# EAGLE schematic IGOR_1 (EAGLE 6.5.0)

## Sheet 1 of 12
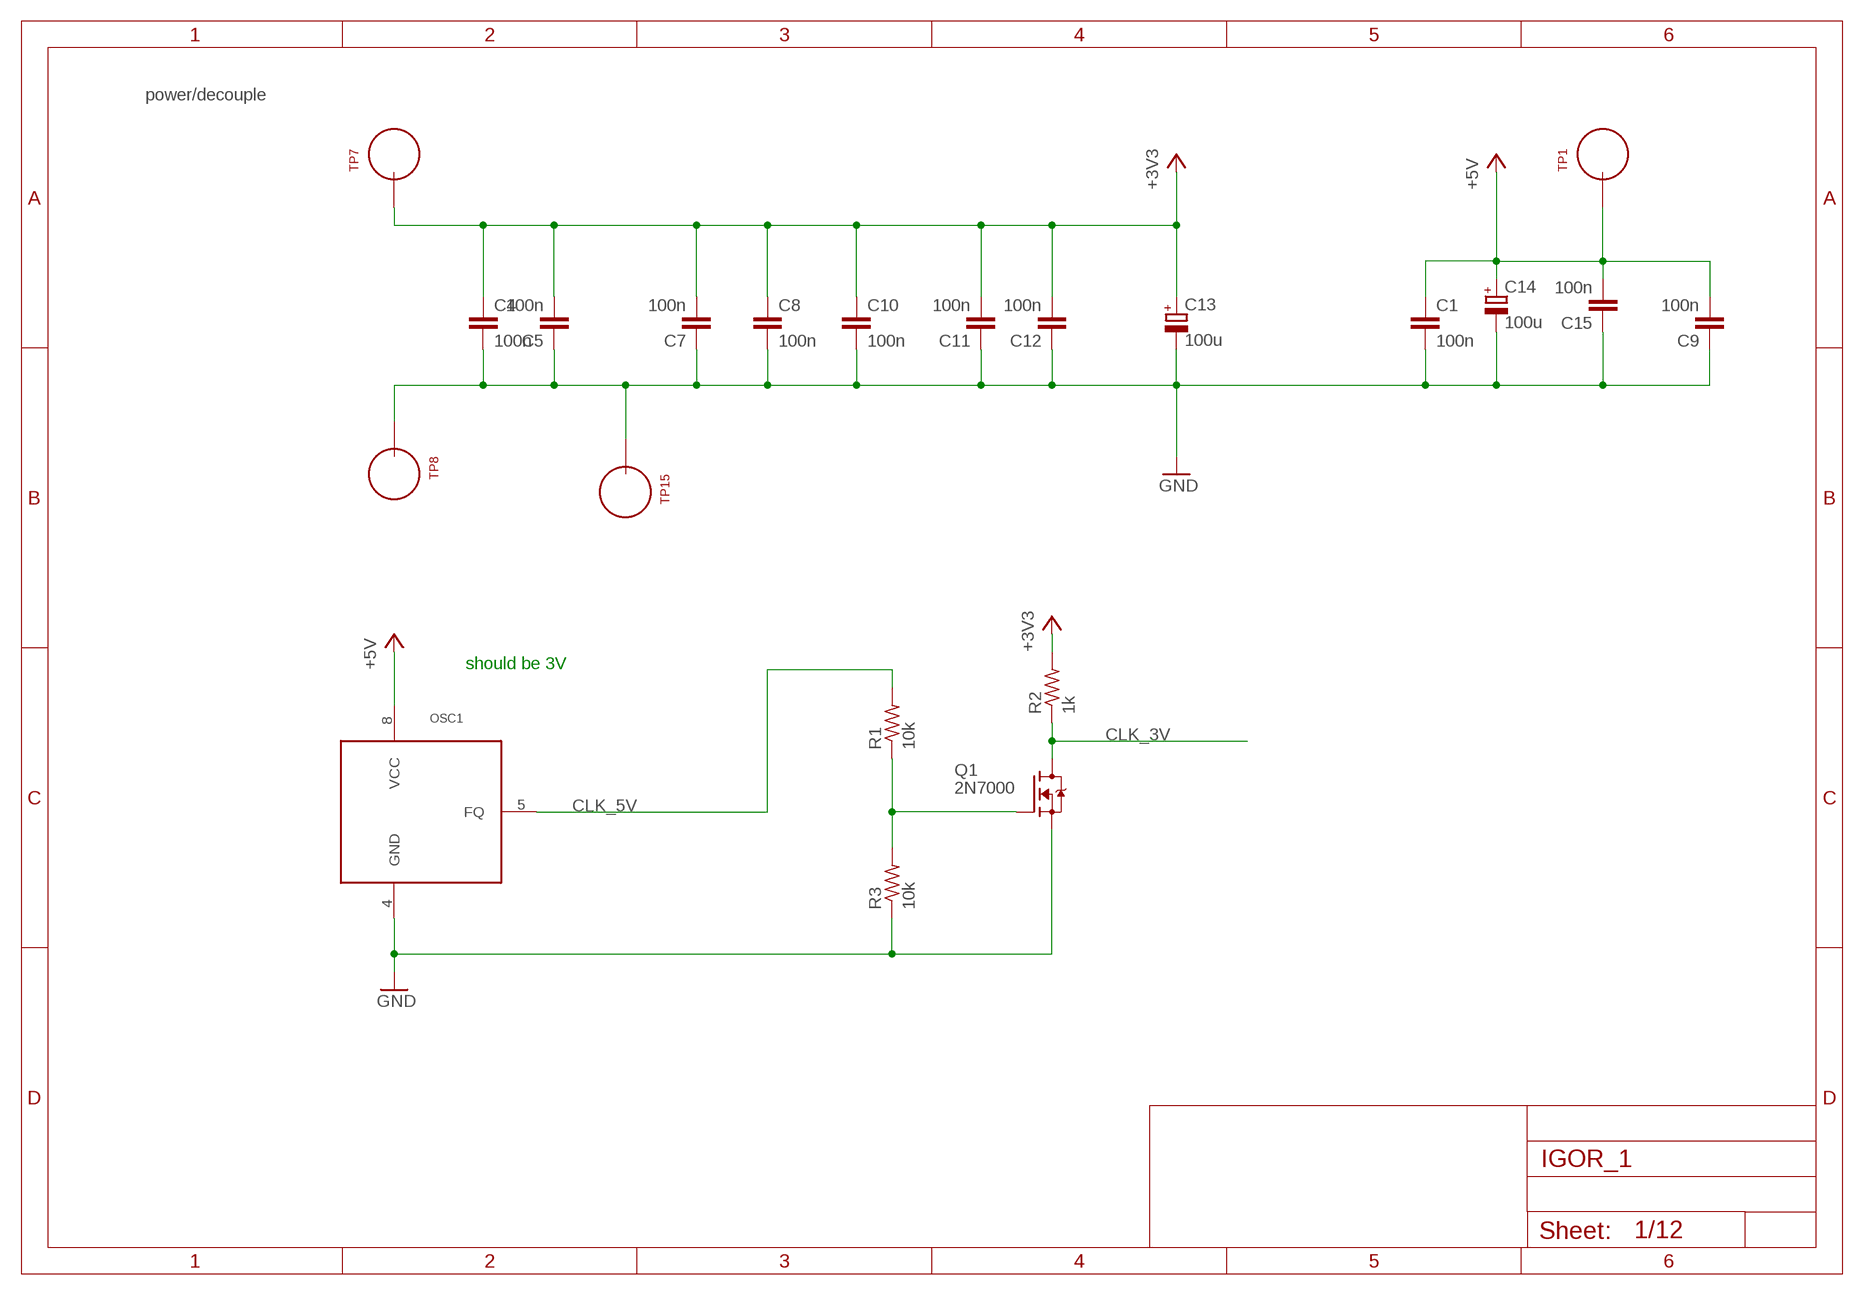
[diagram p0: schematic, sheet 1]

### Parts
C1  100n  C_P2INCH  [CAP_P2INCH]
C4  100n  C_P2INCH  [CAP_P2INCH]
C5  100n  C_P2INCH  [CAP_P2INCH]
C7  100n  C_P2INCH  [CAP_P2INCH]
C8  100n  C_P2INCH  [CAP_P2INCH]
C9  100n  C_P2INCH  [CAP_P2INCH]
C10  100n  C_P2INCH  [CAP_P2INCH]
C11  100n  C_P2INCH  [CAP_P2INCH]
C12  100n  C_P2INCH  [CAP_P2INCH]
C13  100u  POLARISED_CAP_2P5_6P3MM  [POLARISED_CAP_2P5_6P3MM]
C14  100u  POLARISED_CAP_2P5_6P3MM  [POLARISED_CAP_2P5_6P3MM]
C15  100n  C_P2INCH  [CAP_P2INCH]
OSC1  OSC_12P9_MM  [OSC_12P9_MM]
Q1  2N7000  [TO92-DGS]
R1  10k  R_P2INCH  [R_P2INCH]
R2  1k  R_P2INCH  [R_P2INCH]
R3  10k  R_P2INCH  [R_P2INCH]
TP1  TEST_LOOP  [TEST_LOOP]
TP7  TEST_LOOP  [TEST_LOOP]
TP8  TEST_LOOP  [TEST_LOOP]
TP15  TEST_LOOP  [TEST_LOOP]

### Nets
+3V3: C4.1 C5.2 C7.2 C8.1 C10.1 C11.2 C12.2 C13.A R2.2 TP7.P$1 ; also sheet 5,6,7,9,11
+5V: C1.1 C9.2 C14.A C15.2 OSC1.8(VCC) TP1.P$1 ; also sheet 2,5,8
CLK_3V: Q1.D R2.1 ; also sheet 3
CLK_5V: Q1.G R1.1 R3.2
GND: C1.2 C4.2 C5.1 C7.1 C8.2 C9.1 C10.2 C11.1 C12.1 C13.K C14.K C15.1 OSC1.4(GND) Q1.S R3.1 TP8.P$1 TP15.P$1 ; also sheet 2,3,4,5,6,7,8,9,10,11,12
N$3: OSC1.5(FQ) R1.2

### Notes on the sheet
- power/decouple
- should be 3V

## Sheet 2 of 12
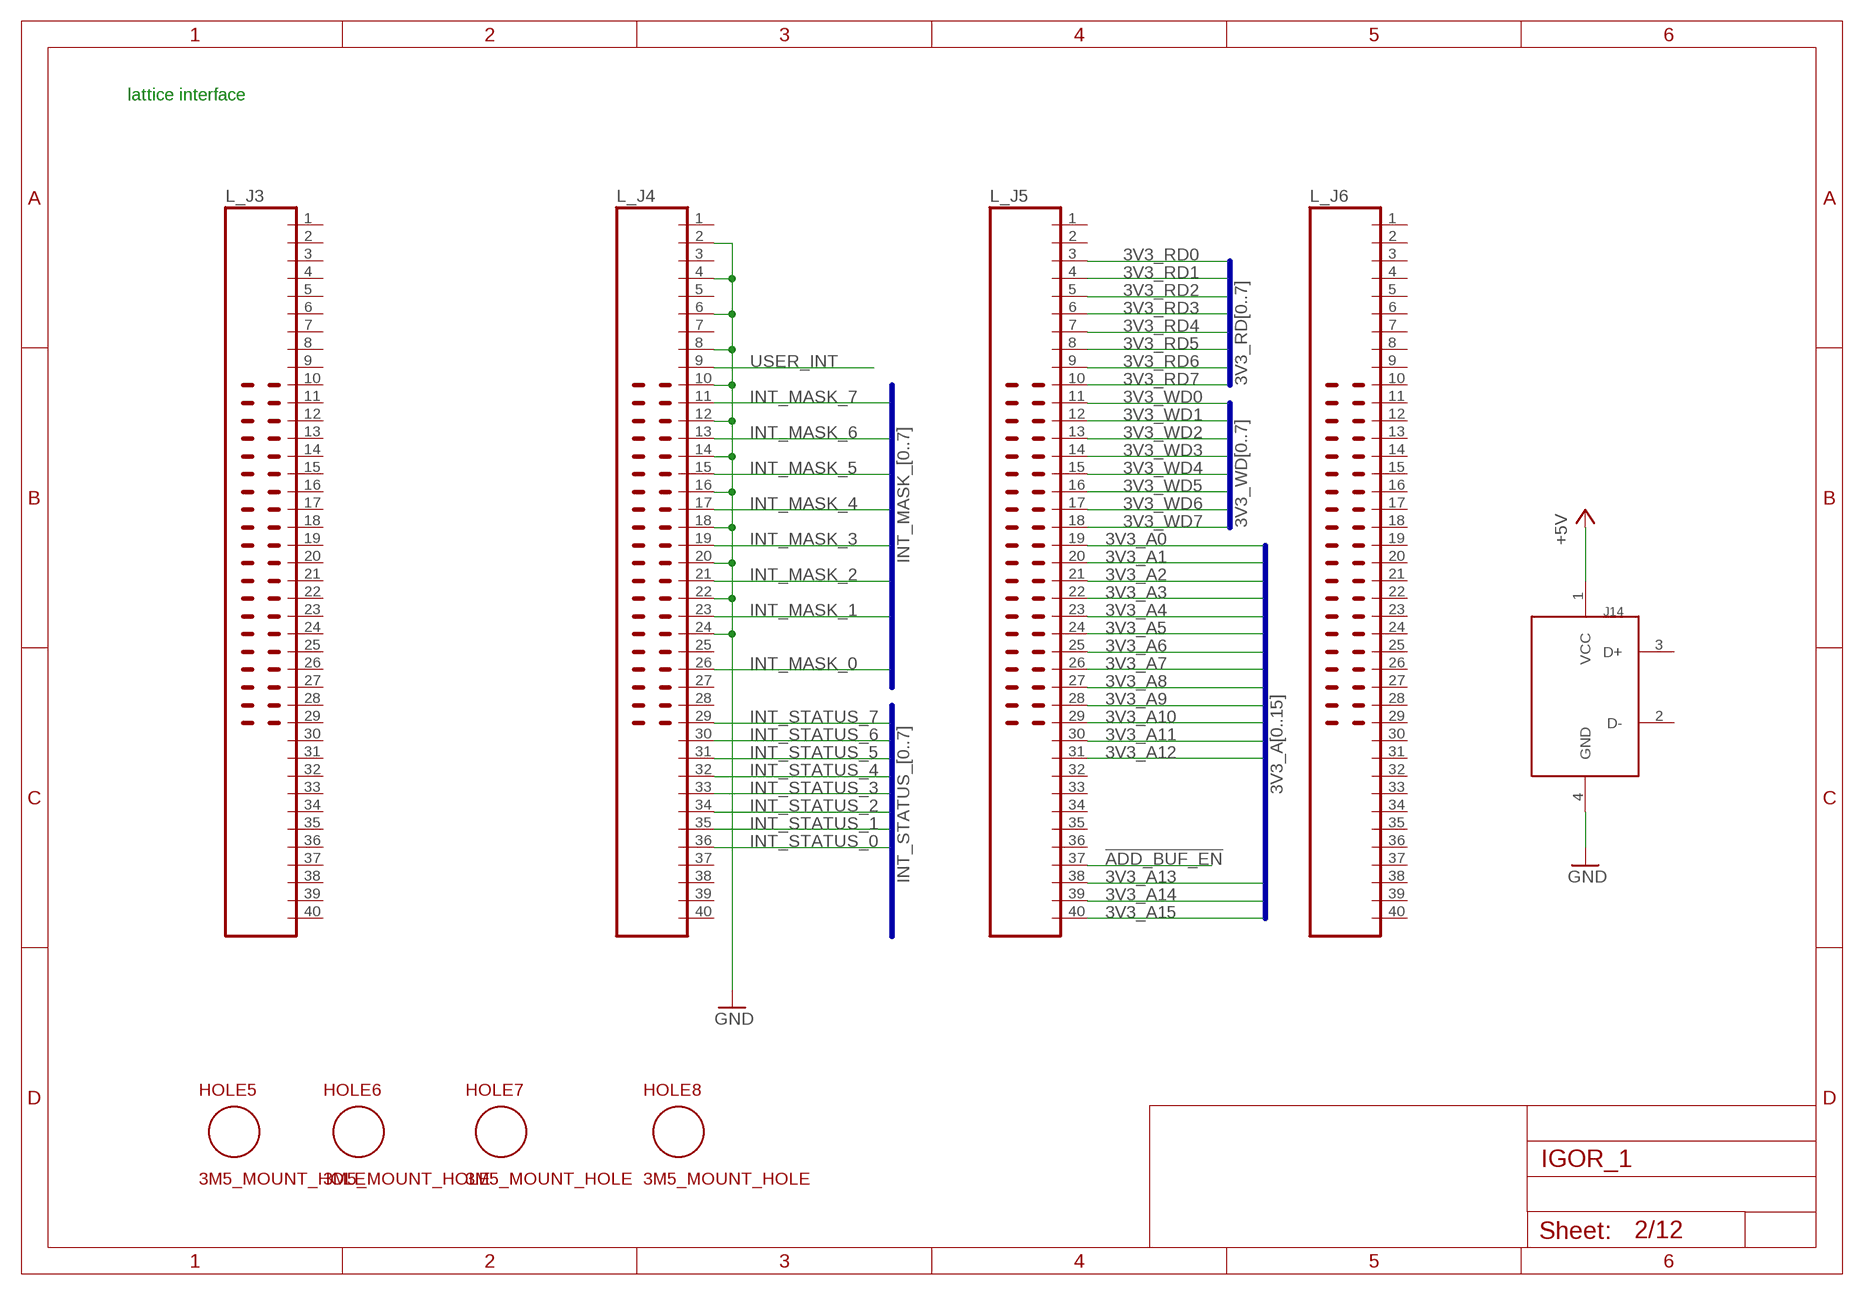
[diagram p1: schematic, sheet 2]

### Parts
HOLE5  3M5_MOUNT_HOLE  [3P5M_HOLE]
HOLE6  3M5_MOUNT_HOLE  [3P5M_HOLE]
HOLE7  3M5_MOUNT_HOLE  [3P5M_HOLE]
HOLE8  3M5_MOUNT_HOLE  [3P5M_HOLE]
J14  USB_TYPE_A  [USB_TYPE_A]
L_J3  JUMP_20X2  [JUMP_20X2]
L_J4  JUMP_20X2  [JUMP_20X2]
L_J5  JUMP_20X2  [JUMP_20X2]
L_J6  JUMP_20X2  [JUMP_20X2]

### Nets
3V3_A0: L_J5.19 ; also sheet 5,7
3V3_A1: L_J5.20 ; also sheet 5,7
3V3_A2: L_J5.21 ; also sheet 5,7
3V3_A3: L_J5.22 ; also sheet 5,7
3V3_A4: L_J5.23 ; also sheet 5,7
3V3_A5: L_J5.24 ; also sheet 5,7
3V3_A6: L_J5.25 ; also sheet 5,7
3V3_A7: L_J5.26 ; also sheet 5,7
3V3_A8: L_J5.27 ; also sheet 5,7
3V3_A9: L_J5.28 ; also sheet 5,7
3V3_A10: L_J5.29 ; also sheet 5,7
3V3_A11: L_J5.30 ; also sheet 5,7
3V3_A12: L_J5.31 ; also sheet 5,7
3V3_A13: L_J5.38 ; also sheet 5,7
3V3_A14: L_J5.39 ; also sheet 5,7
3V3_A15: L_J5.40 ; also sheet 5
3V3_RD0: L_J5.3 ; also sheet 5
3V3_RD1: L_J5.4 ; also sheet 5
3V3_RD2: L_J5.5 ; also sheet 5
3V3_RD3: L_J5.6 ; also sheet 5
3V3_RD4: L_J5.7 ; also sheet 5
3V3_RD5: L_J5.8 ; also sheet 5
3V3_RD6: L_J5.9 ; also sheet 5
3V3_RD7: L_J5.10 ; also sheet 5
3V3_WD0: L_J5.11 ; also sheet 5
3V3_WD1: L_J5.12 ; also sheet 5
3V3_WD2: L_J5.13 ; also sheet 5
3V3_WD3: L_J5.14 ; also sheet 5
3V3_WD4: L_J5.15 ; also sheet 5
3V3_WD5: L_J5.16 ; also sheet 5
3V3_WD6: L_J5.17 ; also sheet 5
3V3_WD7: L_J5.18 ; also sheet 5
!ADD_BUF_EN: L_J5.37 ; also sheet 5
+5V: J14.1(VCC) ; also sheet 1,5,8
GND: J14.4(GND) L_J4.2 L_J4.4 L_J4.6 L_J4.8 L_J4.10 L_J4.12 L_J4.14 L_J4.16 L_J4.18 L_J4.20 L_J4.22 L_J4.24 ; also sheet 1,3,4,5,6,7,8,9,10,11,12
INT_MASK_0: L_J4.26 ; also sheet 12
INT_MASK_1: L_J4.23 ; also sheet 12
INT_MASK_2: L_J4.21 ; also sheet 12
INT_MASK_3: L_J4.19 ; also sheet 12
INT_MASK_4: L_J4.17 ; also sheet 12
INT_MASK_5: L_J4.15 ; also sheet 12
INT_MASK_6: L_J4.13 ; also sheet 12
INT_MASK_7: L_J4.11 ; also sheet 12
INT_STATUS_0: L_J4.36 ; also sheet 11
INT_STATUS_1: L_J4.35 ; also sheet 11
INT_STATUS_2: L_J4.34 ; also sheet 11
INT_STATUS_3: L_J4.33 ; also sheet 11
INT_STATUS_4: L_J4.32 ; also sheet 11
INT_STATUS_5: L_J4.31 ; also sheet 11
INT_STATUS_6: L_J4.30 ; also sheet 11
INT_STATUS_7: L_J4.29 ; also sheet 11
USER_INT: L_J4.9 ; also sheet 11
Unconnected: J14.2(D-) J14.3(D+) L_J3.1 L_J3.2 L_J3.3 L_J3.4 L_J3.5 L_J3.6 L_J3.7 L_J3.8 L_J3.9 L_J3.10 L_J3.11 L_J3.12 L_J3.13 L_J3.14 L_J3.15 L_J3.16 L_J3.17 L_J3.18 L_J3.19 L_J3.20 L_J3.21 L_J3.22 L_J3.23 L_J3.24 L_J3.25 L_J3.26 L_J3.27 L_J3.28 L_J3.29 L_J3.30 L_J3.31 L_J3.32 L_J3.33 L_J3.34 L_J3.35 L_J3.36 L_J3.37 L_J3.38 L_J3.39 L_J3.40 L_J4.1 L_J4.3 L_J4.5 L_J4.7 L_J4.25 L_J4.27 L_J4.28 L_J4.37 L_J4.38 L_J4.39 L_J4.40 L_J5.1 L_J5.2 L_J5.32 L_J5.33 L_J5.34 L_J5.35 L_J5.36 L_J6.1 L_J6.2 L_J6.3 L_J6.4 L_J6.5 L_J6.6 L_J6.7 L_J6.8 L_J6.9 L_J6.10 L_J6.11 L_J6.12 L_J6.13 L_J6.14 L_J6.15 L_J6.16 L_J6.17 L_J6.18 L_J6.19 L_J6.20 L_J6.21 L_J6.22 L_J6.23 L_J6.24 L_J6.25 L_J6.26 L_J6.27 L_J6.28 L_J6.29 L_J6.30 L_J6.31 L_J6.32 L_J6.33 L_J6.34 L_J6.35 L_J6.36 L_J6.37 L_J6.38 L_J6.39 L_J6.40

### Buses
INT_MASK_[0..7]
INT_STATUS_[0..7]
3V3_WD[0..7]
3V3_RD[0..7]
3V3_A[0..15]

### Notes on the sheet
- lattice interface

## Sheet 3 of 12
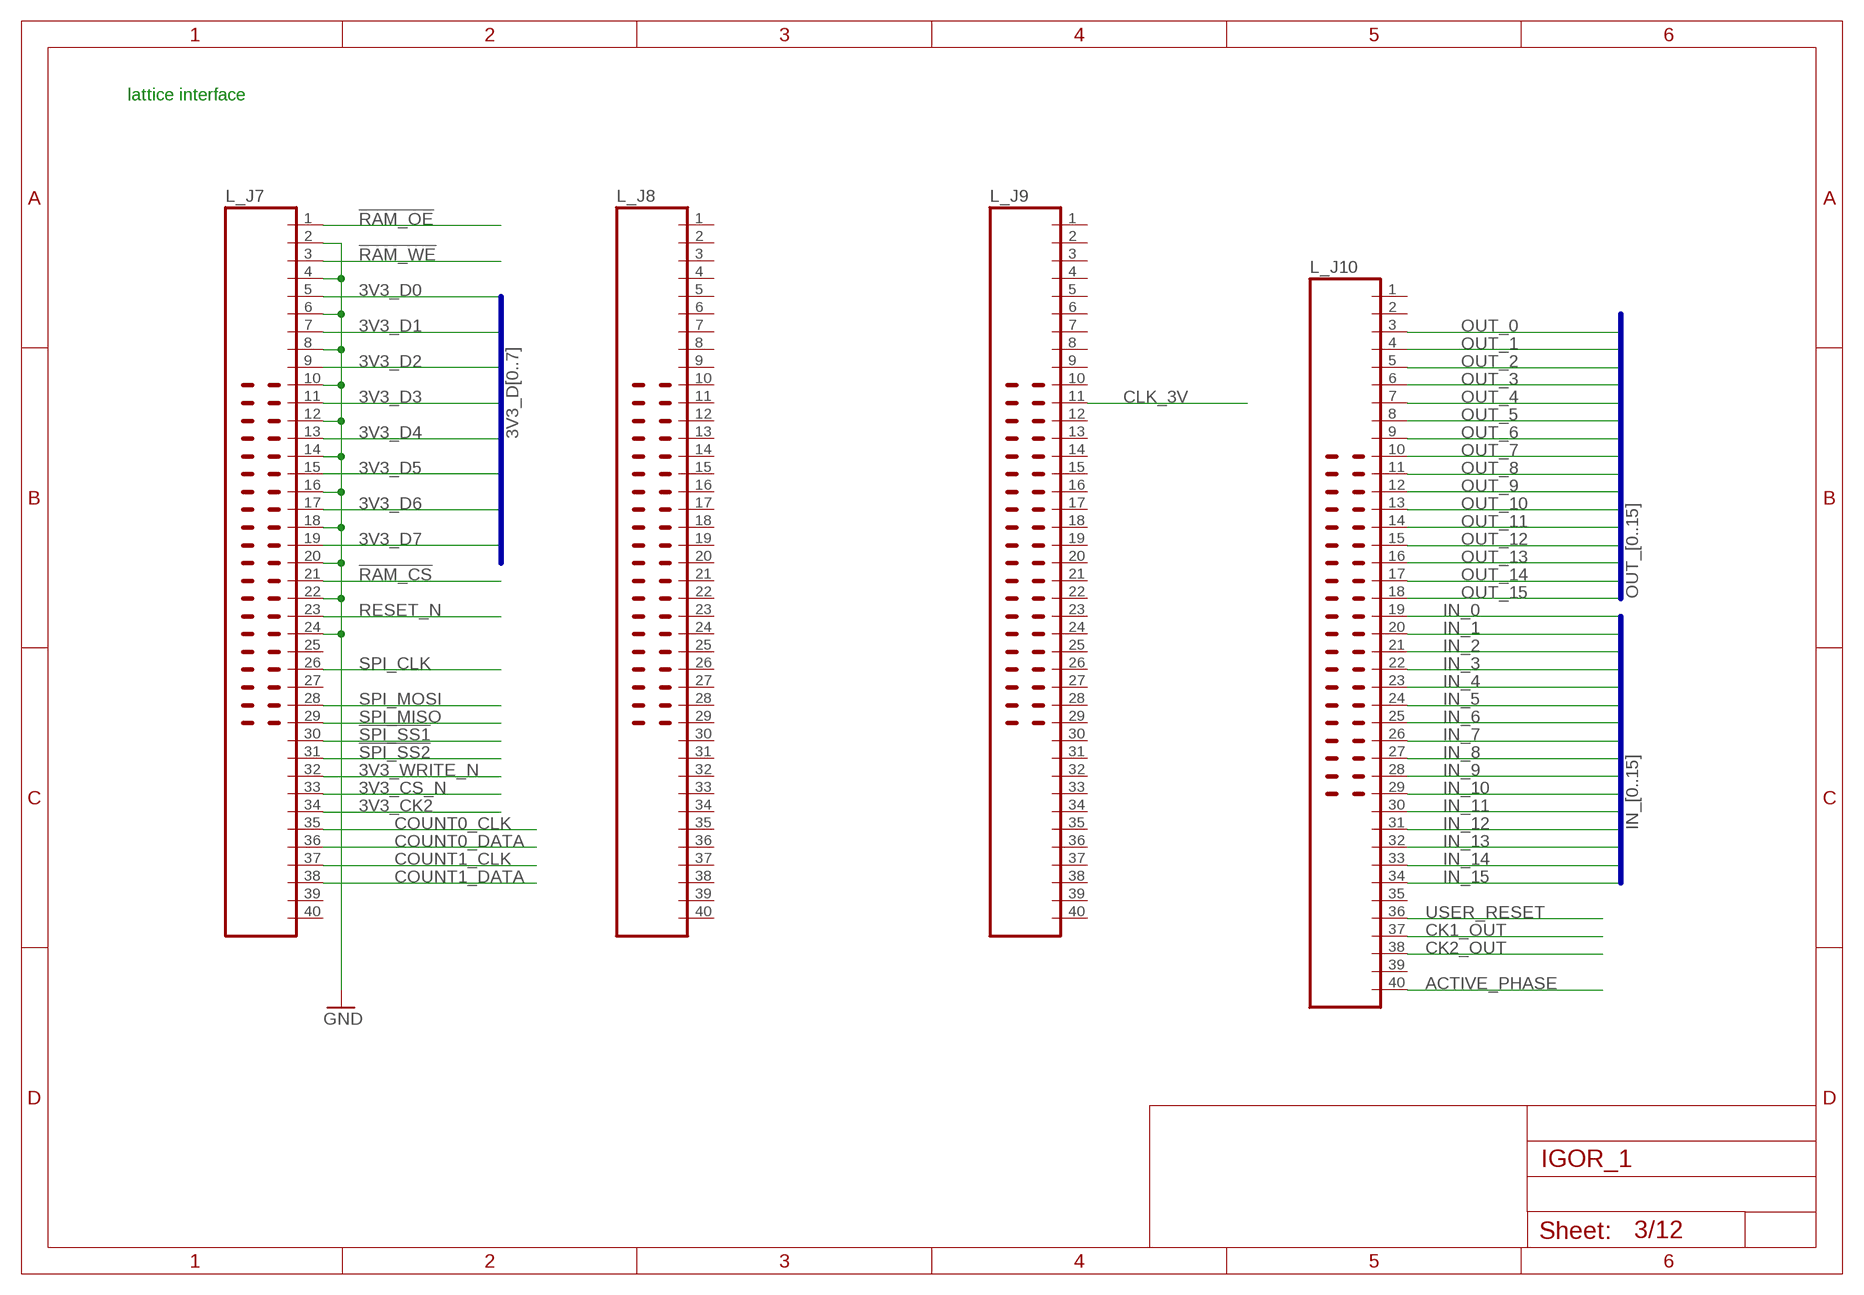
[diagram p2: schematic, sheet 3]

### Parts
L_J7  JUMP_20X2  [JUMP_20X2]
L_J8  JUMP_20X2  [JUMP_20X2]
L_J9  JUMP_20X2  [JUMP_20X2]
L_J10  JUMP_20X2  [JUMP_20X2]

### Nets
3V3_CK2: L_J7.34 ; also sheet 5
3V3_CS_N: L_J7.33 ; also sheet 5
3V3_D0: L_J7.5 ; also sheet 7
3V3_D1: L_J7.7 ; also sheet 7
3V3_D2: L_J7.9 ; also sheet 7
3V3_D3: L_J7.11 ; also sheet 7
3V3_D4: L_J7.13 ; also sheet 7
3V3_D5: L_J7.15 ; also sheet 7
3V3_D6: L_J7.17 ; also sheet 7
3V3_D7: L_J7.19 ; also sheet 7
3V3_WRITE_N: L_J7.32 ; also sheet 5
!RAM_CS: L_J7.21 ; also sheet 7
!RAM_OE: L_J7.1 ; also sheet 7
!RAM_WE: L_J7.3 ; also sheet 7
!SPI_SS1: L_J7.30 ; also sheet 6
!SPI_SS2: L_J7.31 ; also sheet 6
ACTIVE_PHASE: L_J10.40 ; also sheet 8
CK1_OUT: L_J10.37 ; also sheet 8
CK2_OUT: L_J10.38 ; also sheet 8
CLK_3V: L_J9.11 ; also sheet 1
COUNT0_CLK: L_J7.35 ; also sheet 8
COUNT0_DATA: L_J7.36 ; also sheet 8
COUNT1_CLK: L_J7.37 ; also sheet 8
COUNT1_DATA: L_J7.38 ; also sheet 8
GND: L_J7.2 L_J7.4 L_J7.6 L_J7.8 L_J7.10 L_J7.12 L_J7.14 L_J7.16 L_J7.18 L_J7.20 L_J7.22 L_J7.24 ; also sheet 1,2,4,5,6,7,8,9,10,11,12
IN_0: L_J10.19 ; also sheet 9
IN_1: L_J10.20 ; also sheet 9
IN_2: L_J10.21 ; also sheet 9
IN_3: L_J10.22 ; also sheet 9
IN_4: L_J10.23 ; also sheet 9
IN_5: L_J10.24 ; also sheet 9
IN_6: L_J10.25 ; also sheet 9
IN_7: L_J10.26 ; also sheet 9
IN_8: L_J10.27 ; also sheet 9
IN_9: L_J10.28 ; also sheet 9
IN_10: L_J10.29 ; also sheet 9
IN_11: L_J10.30 ; also sheet 9
IN_12: L_J10.31 ; also sheet 9
IN_13: L_J10.32 ; also sheet 9
IN_14: L_J10.33 ; also sheet 9
IN_15: L_J10.34 ; also sheet 9
OUT_0: L_J10.3 ; also sheet 10
OUT_1: L_J10.4 ; also sheet 10
OUT_2: L_J10.5 ; also sheet 10
OUT_3: L_J10.6 ; also sheet 10
OUT_4: L_J10.7 ; also sheet 10
OUT_5: L_J10.8 ; also sheet 10
OUT_6: L_J10.9 ; also sheet 10
OUT_7: L_J10.10 ; also sheet 10
OUT_8: L_J10.11 ; also sheet 10
OUT_9: L_J10.12 ; also sheet 10
OUT_10: L_J10.13 ; also sheet 10
OUT_11: L_J10.14 ; also sheet 10
OUT_12: L_J10.15 ; also sheet 10
OUT_13: L_J10.16 ; also sheet 10
OUT_14: L_J10.17 ; also sheet 10
OUT_15: L_J10.18 ; also sheet 10
RESET_N: L_J7.23 ; also sheet 6
SPI_CLK: L_J7.26 ; also sheet 6
SPI_MISO: L_J7.29 ; also sheet 6
SPI_MOSI: L_J7.28 ; also sheet 6
USER_RESET: L_J10.36 ; also sheet 8
Unconnected: L_J7.25 L_J7.27 L_J7.39 L_J7.40 L_J8.1 L_J8.2 L_J8.3 L_J8.4 L_J8.5 L_J8.6 L_J8.7 L_J8.8 L_J8.9 L_J8.10 L_J8.11 L_J8.12 L_J8.13 L_J8.14 L_J8.15 L_J8.16 L_J8.17 L_J8.18 L_J8.19 L_J8.20 L_J8.21 L_J8.22 L_J8.23 L_J8.24 L_J8.25 L_J8.26 L_J8.27 L_J8.28 L_J8.29 L_J8.30 L_J8.31 L_J8.32 L_J8.33 L_J8.34 L_J8.35 L_J8.36 L_J8.37 L_J8.38 L_J8.39 L_J8.40 L_J9.1 L_J9.2 L_J9.3 L_J9.4 L_J9.5 L_J9.6 L_J9.7 L_J9.8 L_J9.9 L_J9.10 L_J9.12 L_J9.13 L_J9.14 L_J9.15 L_J9.16 L_J9.17 L_J9.18 L_J9.19 L_J9.20 L_J9.21 L_J9.22 L_J9.23 L_J9.24 L_J9.25 L_J9.26 L_J9.27 L_J9.28 L_J9.29 L_J9.30 L_J9.31 L_J9.32 L_J9.33 L_J9.34 L_J9.35 L_J9.36 L_J9.37 L_J9.38 L_J9.39 L_J9.40 L_J10.1 L_J10.2 L_J10.35 L_J10.39

### Buses
OUT_[0..15]
IN_[0..15]
3V3_D[0..7]

### Notes on the sheet
- lattice interface

## Sheet 4 of 12
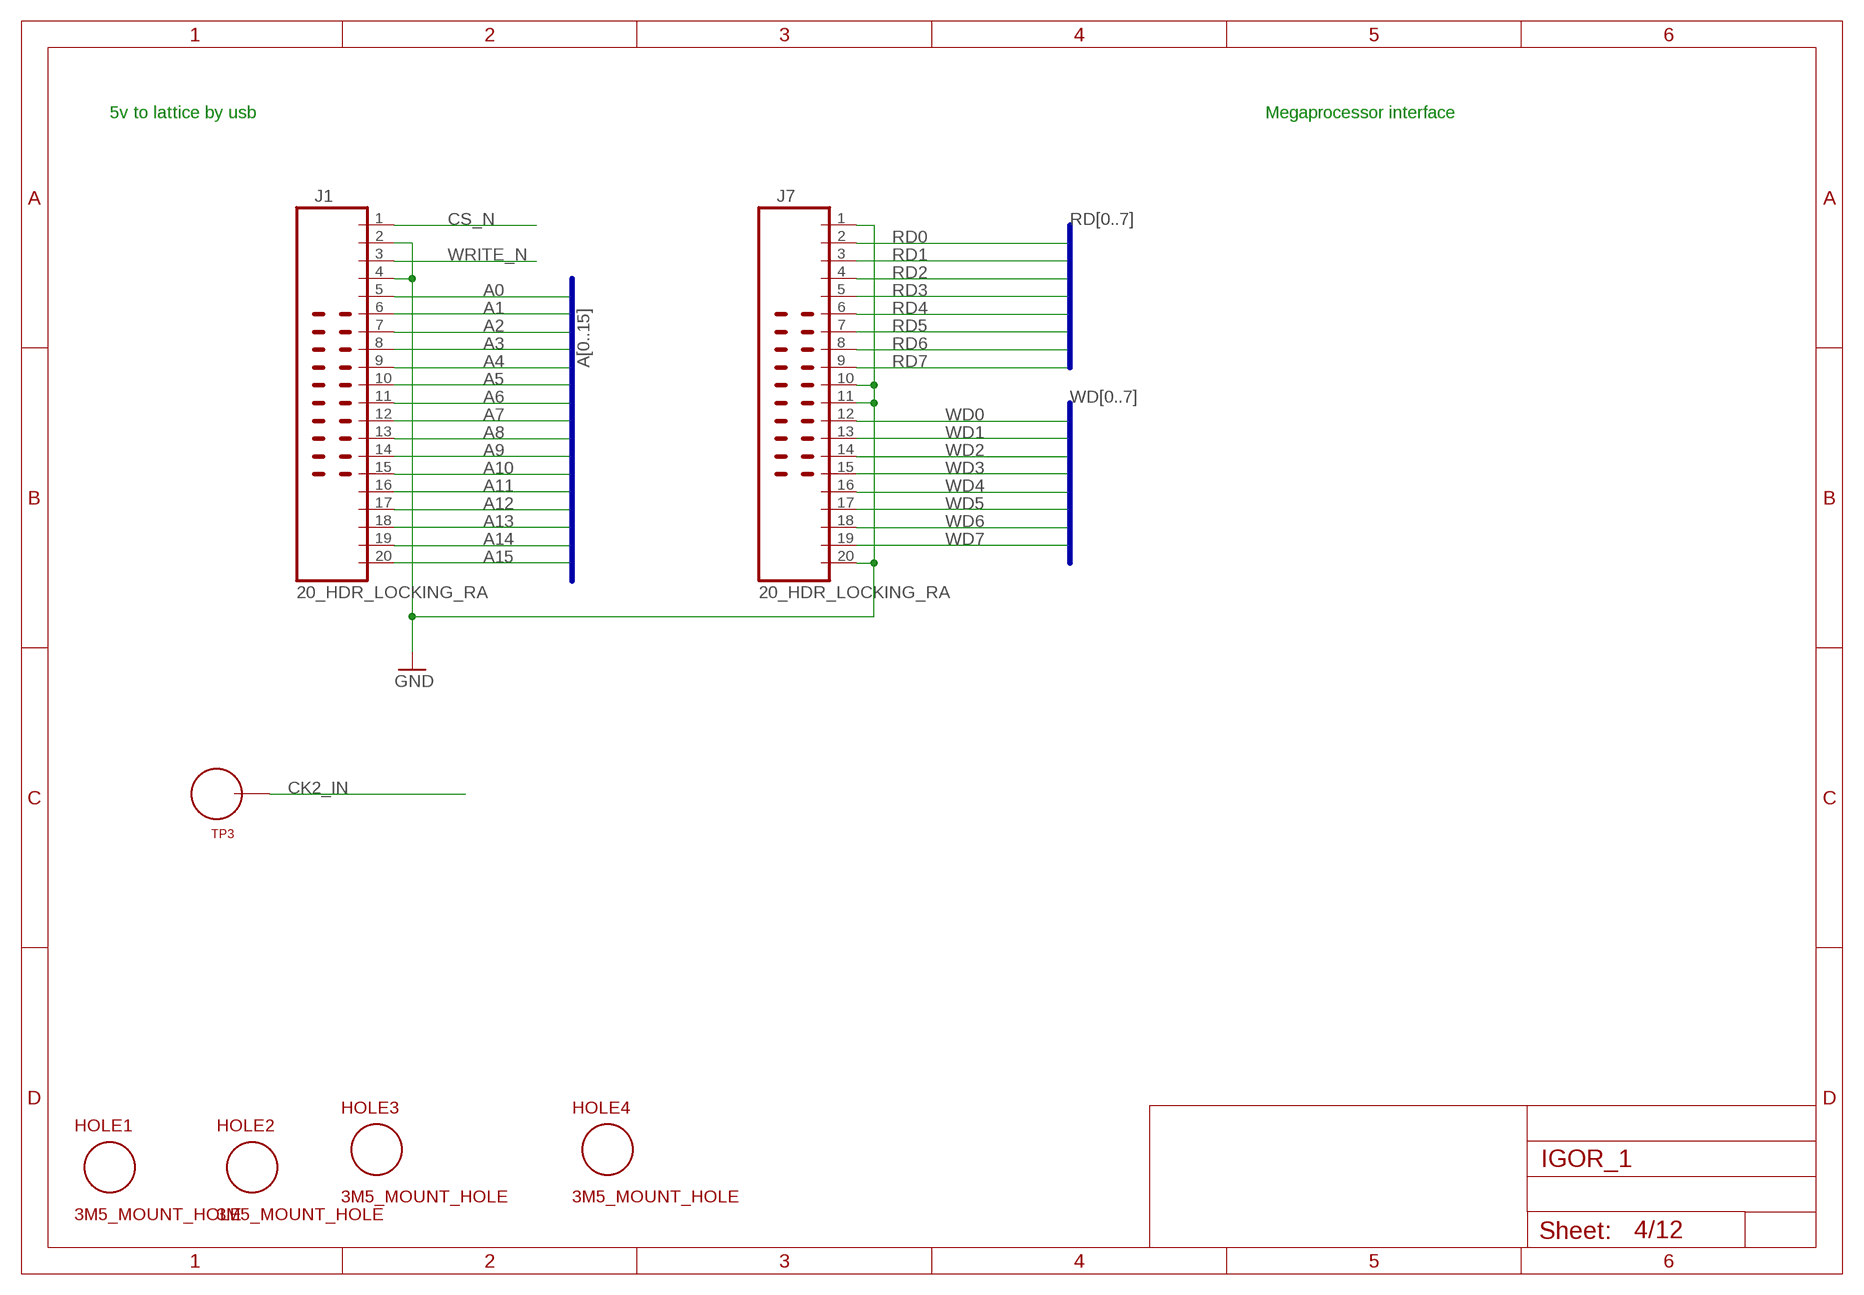
[diagram p3: schematic, sheet 4]

### Parts
HOLE1  3M5_MOUNT_HOLE  [3P5M_HOLE]
HOLE2  3M5_MOUNT_HOLE  [3P5M_HOLE]
HOLE3  3M5_MOUNT_HOLE  [3P5M_HOLE]
HOLE4  3M5_MOUNT_HOLE  [3P5M_HOLE]
J1  20_HDR_LOCKING_RA  [20_HDR_LOCKING_RA]
J7  20_HDR_LOCKING_RA  [20_HDR_LOCKING_RA]
TP3  TEST_LOOP  [TEST_LOOP]

### Nets
A0: J1.5 ; also sheet 5
A1: J1.6 ; also sheet 5
A2: J1.7 ; also sheet 5
A3: J1.8 ; also sheet 5
A4: J1.9 ; also sheet 5
A5: J1.10 ; also sheet 5
A6: J1.11 ; also sheet 5
A7: J1.12 ; also sheet 5
A8: J1.13 ; also sheet 5
A9: J1.14 ; also sheet 5
A10: J1.15 ; also sheet 5
A11: J1.16 ; also sheet 5
A12: J1.17 ; also sheet 5
A13: J1.18 ; also sheet 5
A14: J1.19 ; also sheet 5
A15: J1.20 ; also sheet 5
CK2_IN: TP3.P$1 ; also sheet 5
CS_N: J1.1 ; also sheet 5
GND: J1.2 J1.4 J7.1 J7.10 J7.11 J7.20 ; also sheet 1,2,3,5,6,7,8,9,10,11,12
RD0: J7.2 ; also sheet 5
RD1: J7.3 ; also sheet 5
RD2: J7.4 ; also sheet 5
RD3: J7.5 ; also sheet 5
RD4: J7.6 ; also sheet 5
RD5: J7.7 ; also sheet 5
RD6: J7.8 ; also sheet 5
RD7: J7.9 ; also sheet 5
WD0: J7.12 ; also sheet 5
WD1: J7.13 ; also sheet 5
WD2: J7.14 ; also sheet 5
WD3: J7.15 ; also sheet 5
WD4: J7.16 ; also sheet 5
WD5: J7.17 ; also sheet 5
WD6: J7.18 ; also sheet 5
WD7: J7.19 ; also sheet 5
WRITE_N: J1.3 ; also sheet 5

### Buses
A[0..15]
RD[0..7]
WD[0..7]

### Notes on the sheet
- 5v to lattice by usb | Megaprocessor interface

## Sheet 5 of 12
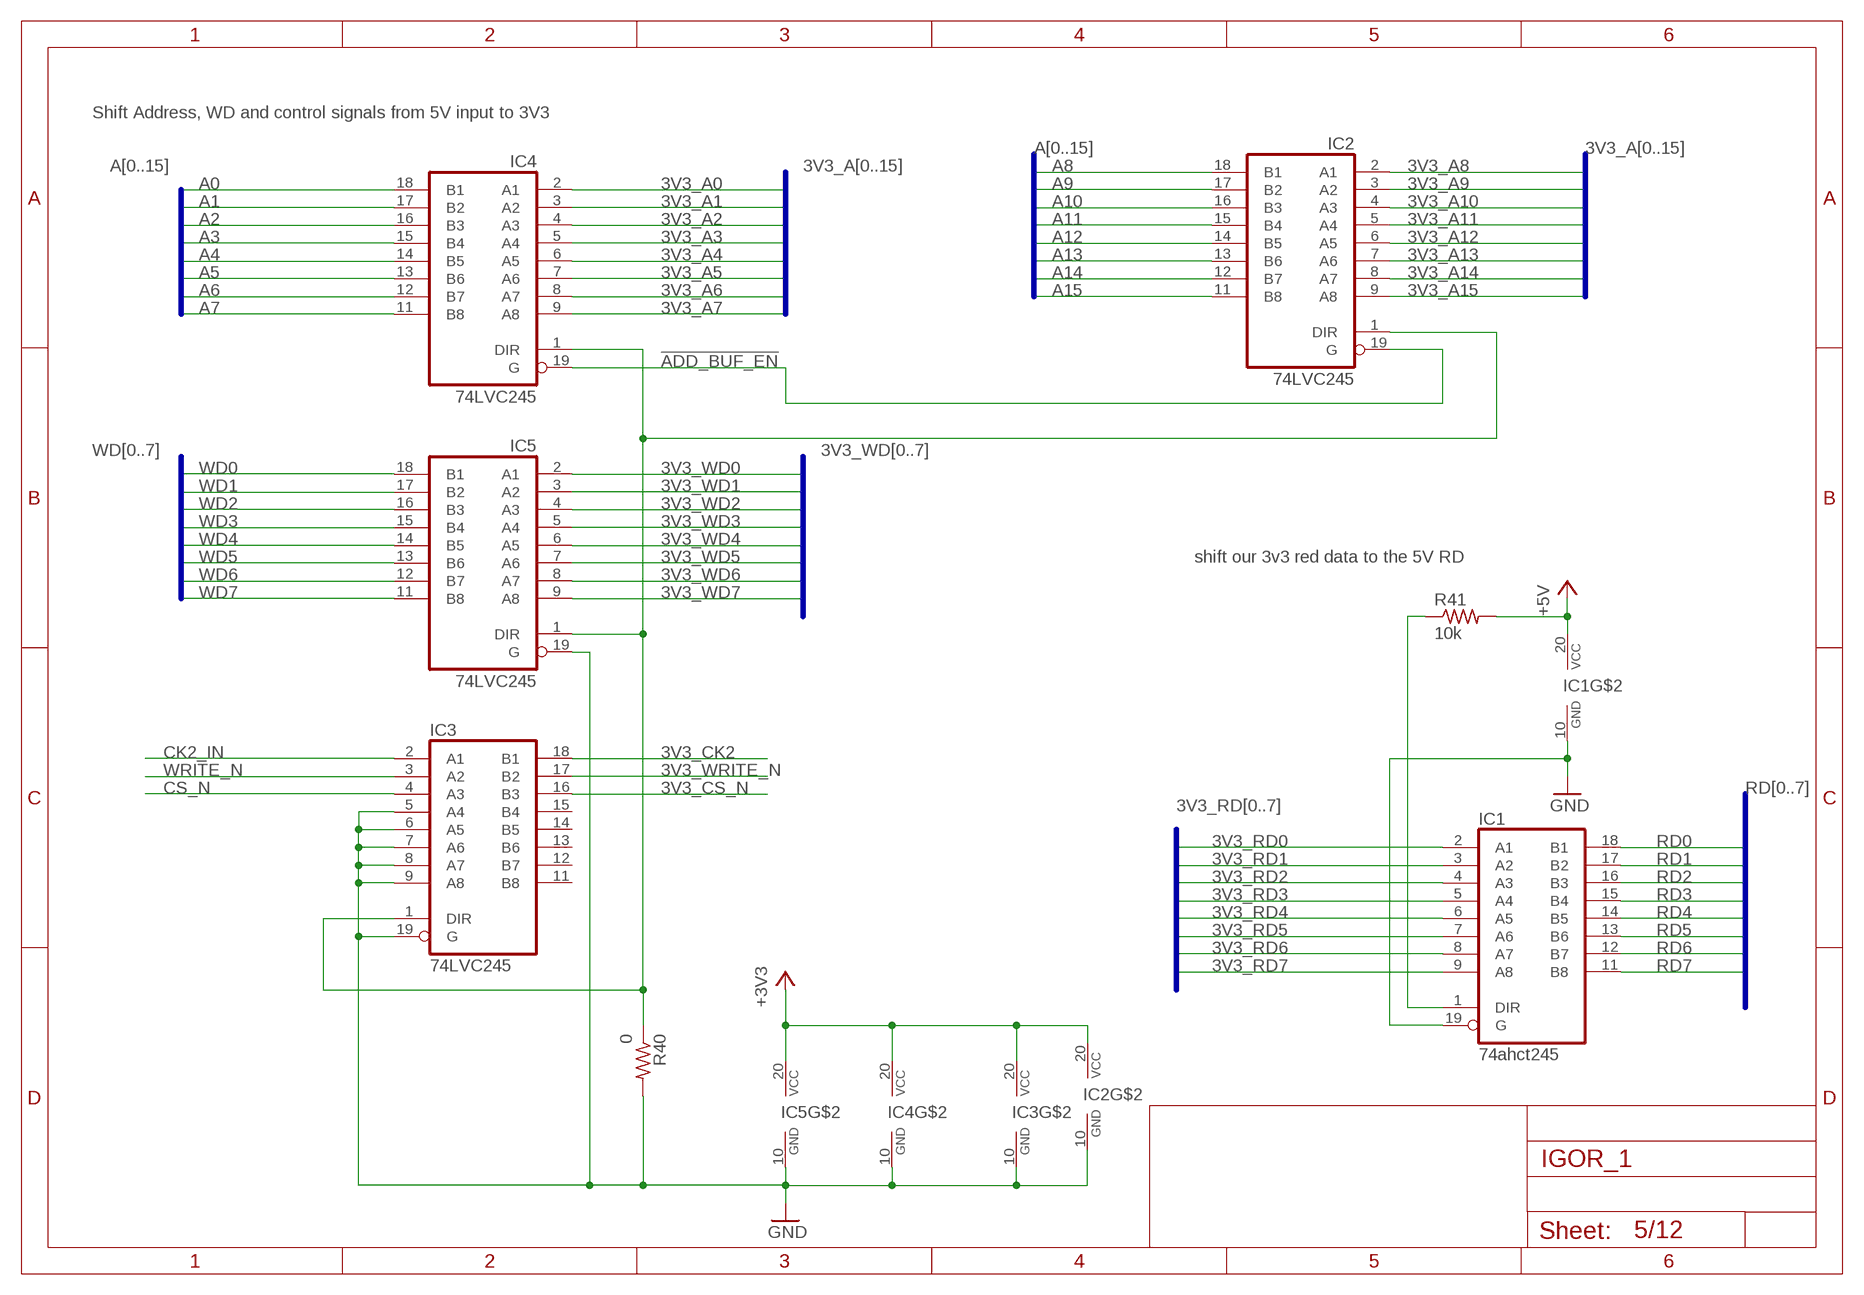
[diagram p4: schematic, sheet 5]

### Parts
IC1  74ahct245  74245  [DIP20]
IC2  74LVC245  74245  [DIP20]
IC3  74LVC245  74245  [DIP20]
IC4  74LVC245  74245  [DIP20]
IC5  74LVC245  74245  [DIP20]
R40  0  R_P2INCH  [R_P2INCH]
R41  10k  R_P2INCH  [R_P2INCH]

### Nets
3V3_A0: IC4.2(A1) ; also sheet 2,7
3V3_A1: IC4.3(A2) ; also sheet 2,7
3V3_A2: IC4.4(A3) ; also sheet 2,7
3V3_A3: IC4.5(A4) ; also sheet 2,7
3V3_A4: IC4.6(A5) ; also sheet 2,7
3V3_A5: IC4.7(A6) ; also sheet 2,7
3V3_A6: IC4.8(A7) ; also sheet 2,7
3V3_A7: IC4.9(A8) ; also sheet 2,7
3V3_A8: IC2.2(A1) ; also sheet 2,7
3V3_A9: IC2.3(A2) ; also sheet 2,7
3V3_A10: IC2.4(A3) ; also sheet 2,7
3V3_A11: IC2.5(A4) ; also sheet 2,7
3V3_A12: IC2.6(A5) ; also sheet 2,7
3V3_A13: IC2.7(A6) ; also sheet 2,7
3V3_A14: IC2.8(A7) ; also sheet 2,7
3V3_A15: IC2.9(A8) ; also sheet 2
3V3_CK2: IC3.18(B1) ; also sheet 3
3V3_CS_N: IC3.16(B3) ; also sheet 3
3V3_RD0: IC1.2(A1) ; also sheet 2
3V3_RD1: IC1.3(A2) ; also sheet 2
3V3_RD2: IC1.4(A3) ; also sheet 2
3V3_RD3: IC1.5(A4) ; also sheet 2
3V3_RD4: IC1.6(A5) ; also sheet 2
3V3_RD5: IC1.7(A6) ; also sheet 2
3V3_RD6: IC1.8(A7) ; also sheet 2
3V3_RD7: IC1.9(A8) ; also sheet 2
3V3_WD0: IC5.2(A1) ; also sheet 2
3V3_WD1: IC5.3(A2) ; also sheet 2
3V3_WD2: IC5.4(A3) ; also sheet 2
3V3_WD3: IC5.5(A4) ; also sheet 2
3V3_WD4: IC5.6(A5) ; also sheet 2
3V3_WD5: IC5.7(A6) ; also sheet 2
3V3_WD6: IC5.8(A7) ; also sheet 2
3V3_WD7: IC5.9(A8) ; also sheet 2
3V3_WRITE_N: IC3.17(B2) ; also sheet 3
!ADD_BUF_EN: IC2.19(G) IC4.19(G) ; also sheet 2
+3V3: IC2.20(VCC) IC3.20(VCC) IC4.20(VCC) IC5.20(VCC) ; also sheet 1,6,7,9,11
+5V: IC1.20(VCC) R41.2 ; also sheet 1,2,8
A0: IC4.18(B1) ; also sheet 4
A1: IC4.17(B2) ; also sheet 4
A2: IC4.16(B3) ; also sheet 4
A3: IC4.15(B4) ; also sheet 4
A4: IC4.14(B5) ; also sheet 4
A5: IC4.13(B6) ; also sheet 4
A6: IC4.12(B7) ; also sheet 4
A7: IC4.11(B8) ; also sheet 4
A8: IC2.18(B1) ; also sheet 4
A9: IC2.17(B2) ; also sheet 4
A10: IC2.16(B3) ; also sheet 4
A11: IC2.15(B4) ; also sheet 4
A12: IC2.14(B5) ; also sheet 4
A13: IC2.13(B6) ; also sheet 4
A14: IC2.12(B7) ; also sheet 4
A15: IC2.11(B8) ; also sheet 4
CK2_IN: IC3.2(A1) ; also sheet 4
CS_N: IC3.4(A3) ; also sheet 4
GND: IC1.10(GND) IC1.19(G) IC2.10(GND) IC3.5(A4) IC3.6(A5) IC3.7(A6) IC3.8(A7) IC3.9(A8) IC3.10(GND) IC3.19(G) IC4.10(GND) IC5.10(GND) IC5.19(G) R40.2 ; also sheet 1,2,3,4,6,7,8,9,10,11,12
N$44: IC2.1(DIR) IC3.1(DIR) IC4.1(DIR) IC5.1(DIR) R40.1
N$46: IC1.1(DIR) R41.1
RD0: IC1.18(B1) ; also sheet 4
RD1: IC1.17(B2) ; also sheet 4
RD2: IC1.16(B3) ; also sheet 4
RD3: IC1.15(B4) ; also sheet 4
RD4: IC1.14(B5) ; also sheet 4
RD5: IC1.13(B6) ; also sheet 4
RD6: IC1.12(B7) ; also sheet 4
RD7: IC1.11(B8) ; also sheet 4
WD0: IC5.18(B1) ; also sheet 4
WD1: IC5.17(B2) ; also sheet 4
WD2: IC5.16(B3) ; also sheet 4
WD3: IC5.15(B4) ; also sheet 4
WD4: IC5.14(B5) ; also sheet 4
WD5: IC5.13(B6) ; also sheet 4
WD6: IC5.12(B7) ; also sheet 4
WD7: IC5.11(B8) ; also sheet 4
WRITE_N: IC3.3(A2) ; also sheet 4
Unconnected: IC3.11(B8) IC3.12(B7) IC3.13(B6) IC3.14(B5) IC3.15(B4)

### Buses
A[0..15]
3V3_A[0..15]
WD[0..7]
3V3_WD[0..7]
3V3_RD[0..7]
RD[0..7]

### Notes on the sheet
- Shift Address, WD and control signals from 5V input to 3V3
- shift our 3v3 red data to the 5V RD

## Sheet 6 of 12
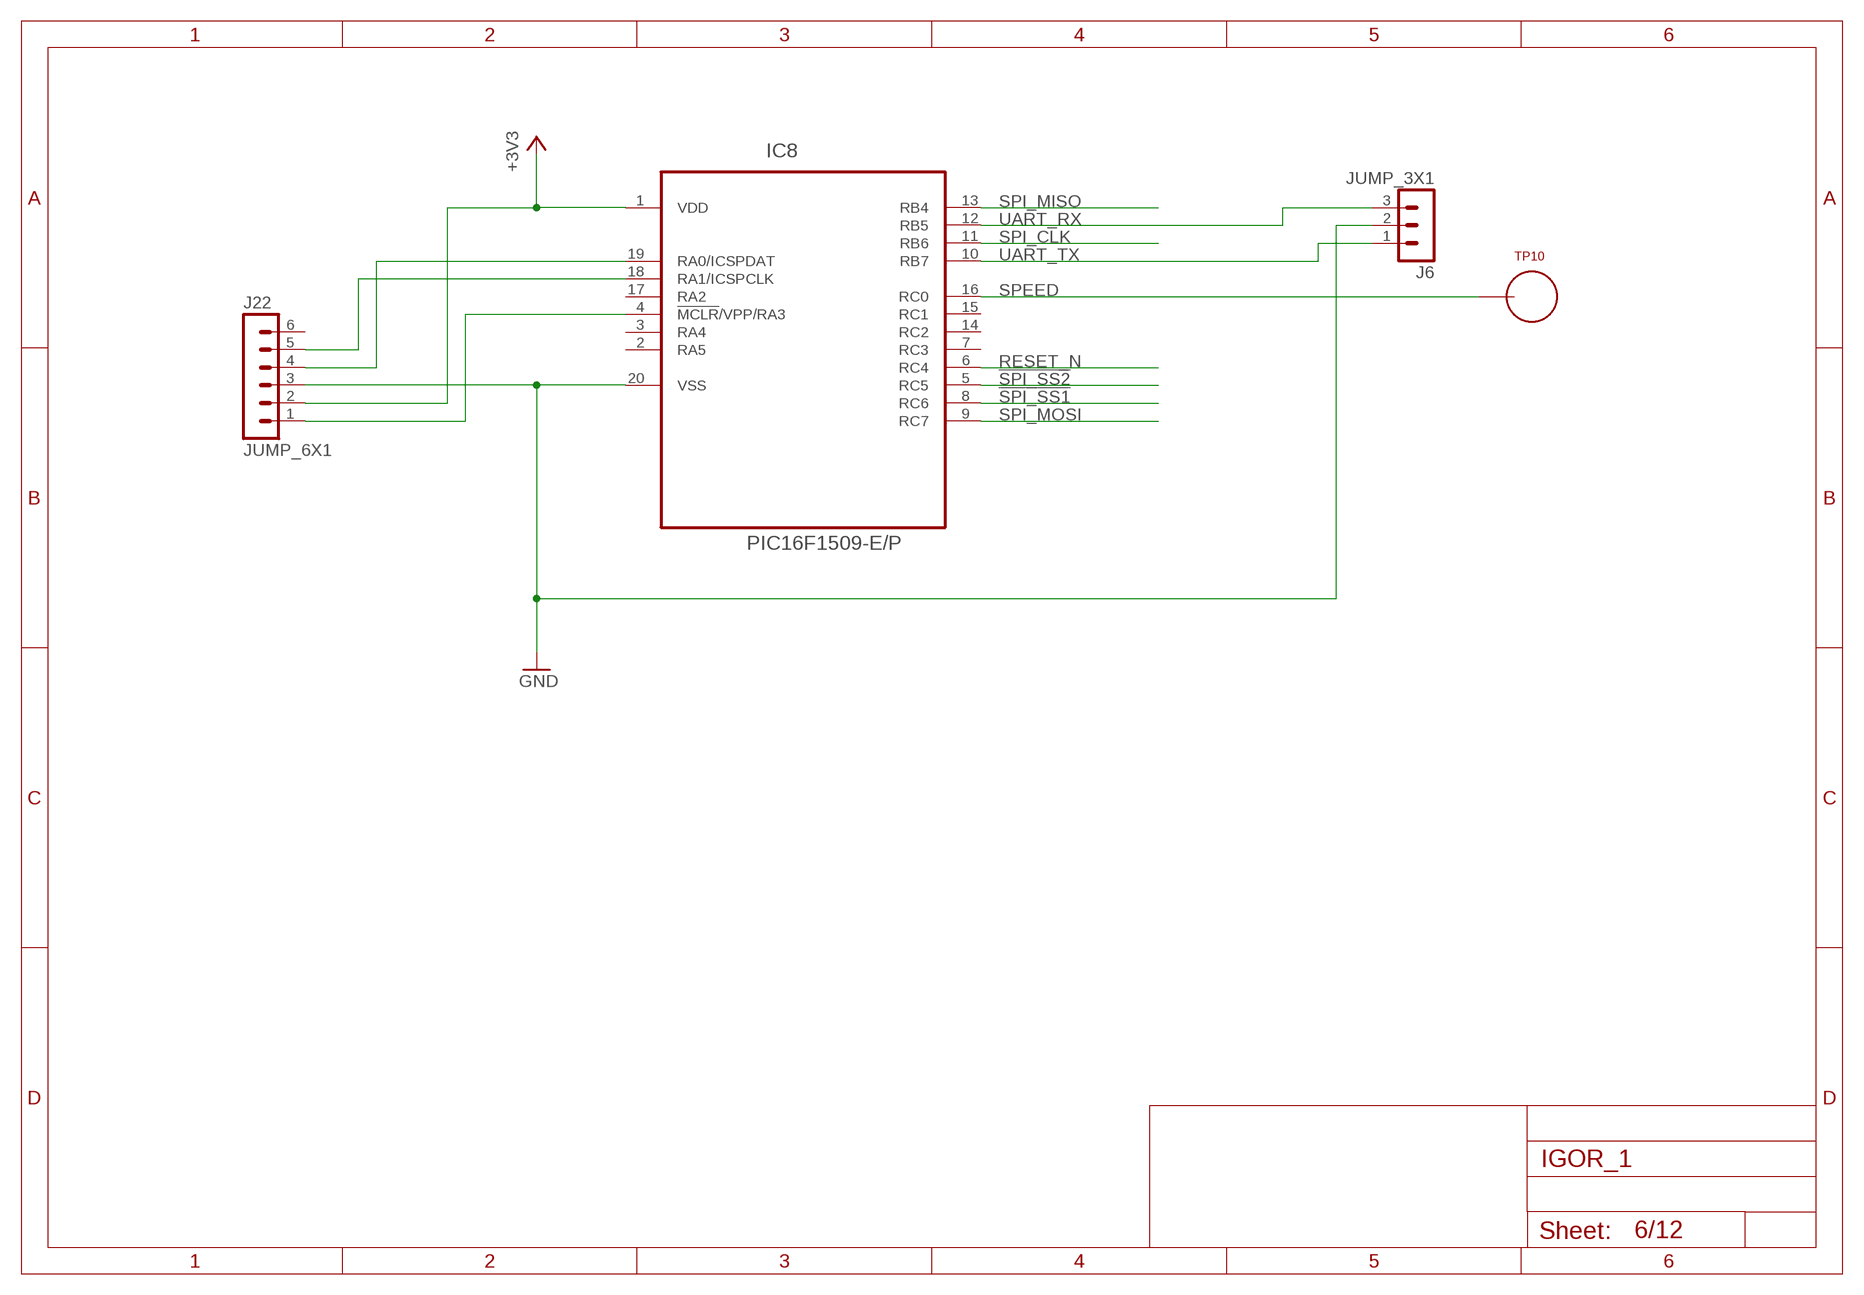
[diagram p5: schematic, sheet 6]

### Parts
IC8  PIC16F1509-E/P  [DIP20]
J6  JUMP_3X1  [JUMP_3X1]
J22  JUMP_6X1  [JUMP_6X1]
TP10  TEST_LOOP  [TEST_LOOP]

### Nets
!SPI_SS1: IC8.8(RC6) ; also sheet 3
!SPI_SS2: IC8.5(RC5) ; also sheet 3
+3V3: IC8.1(VDD) J22.2 ; also sheet 1,5,7,9,11
GND: IC8.20(VSS) J6.2 J22.3 ; also sheet 1,2,3,4,5,7,8,9,10,11,12
N$15: IC8.19(RA0/ICSPDAT) J22.4
N$16: IC8.18(RA1/ICSPCLK) J22.5
N$17: IC8.4(!MCLR!/VPP/RA3) J22.1
RESET_N: IC8.6(RC4) ; also sheet 3
SPEED: IC8.16(RC0) TP10.P$1
SPI_CLK: IC8.11(RB6) ; also sheet 3
SPI_MISO: IC8.13(RB4) ; also sheet 3
SPI_MOSI: IC8.9(RC7) ; also sheet 3
UART_RX: IC8.12(RB5) J6.3
UART_TX: IC8.10(RB7) J6.1
Unconnected: IC8.2(RA5) IC8.3(RA4) IC8.7(RC3) IC8.14(RC2) IC8.15(RC1) IC8.17(RA2) J22.6

## Sheet 7 of 12
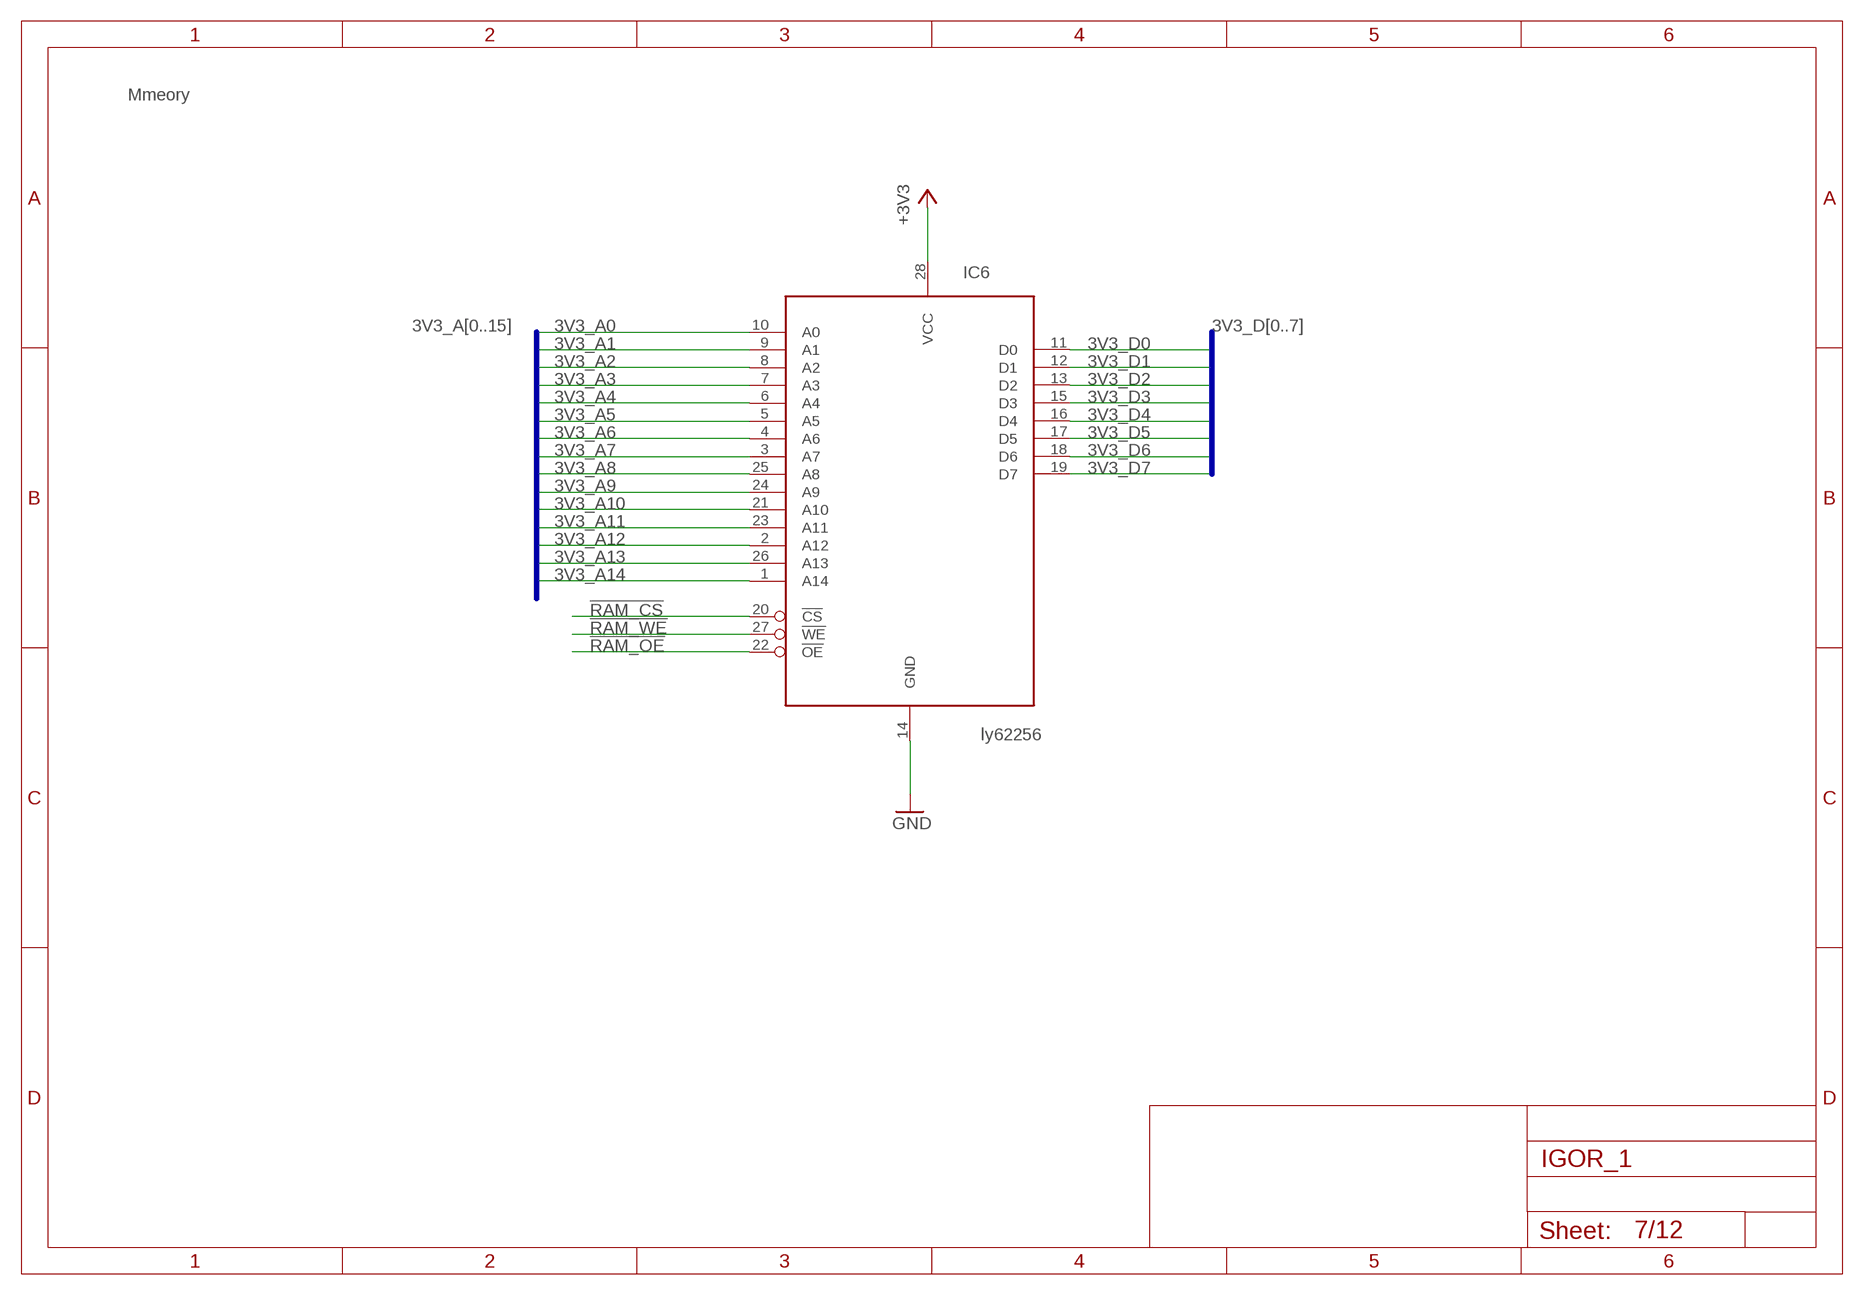
[diagram p6: schematic, sheet 7]

### Parts
IC6  ly62256  62256  [DIP28]

### Nets
3V3_A0: IC6.10(A0) ; also sheet 2,5
3V3_A1: IC6.9(A1) ; also sheet 2,5
3V3_A2: IC6.8(A2) ; also sheet 2,5
3V3_A3: IC6.7(A3) ; also sheet 2,5
3V3_A4: IC6.6(A4) ; also sheet 2,5
3V3_A5: IC6.5(A5) ; also sheet 2,5
3V3_A6: IC6.4(A6) ; also sheet 2,5
3V3_A7: IC6.3(A7) ; also sheet 2,5
3V3_A8: IC6.25(A8) ; also sheet 2,5
3V3_A9: IC6.24(A9) ; also sheet 2,5
3V3_A10: IC6.21(A10) ; also sheet 2,5
3V3_A11: IC6.23(A11) ; also sheet 2,5
3V3_A12: IC6.2(A12) ; also sheet 2,5
3V3_A13: IC6.26(A13) ; also sheet 2,5
3V3_A14: IC6.1(A14) ; also sheet 2,5
3V3_D0: IC6.11(D0) ; also sheet 3
3V3_D1: IC6.12(D1) ; also sheet 3
3V3_D2: IC6.13(D2) ; also sheet 3
3V3_D3: IC6.15(D3) ; also sheet 3
3V3_D4: IC6.16(D4) ; also sheet 3
3V3_D5: IC6.17(D5) ; also sheet 3
3V3_D6: IC6.18(D6) ; also sheet 3
3V3_D7: IC6.19(D7) ; also sheet 3
!RAM_CS: IC6.20(!CS) ; also sheet 3
!RAM_OE: IC6.22(!OE) ; also sheet 3
!RAM_WE: IC6.27(!WE) ; also sheet 3
+3V3: IC6.28(VCC) ; also sheet 1,5,6,9,11
GND: IC6.14(GND) ; also sheet 1,2,3,4,5,6,8,9,10,11,12

### Buses
3V3_A[0..15]
3V3_D[0..7]

### Notes on the sheet
- Mmeory

## Sheet 8 of 12
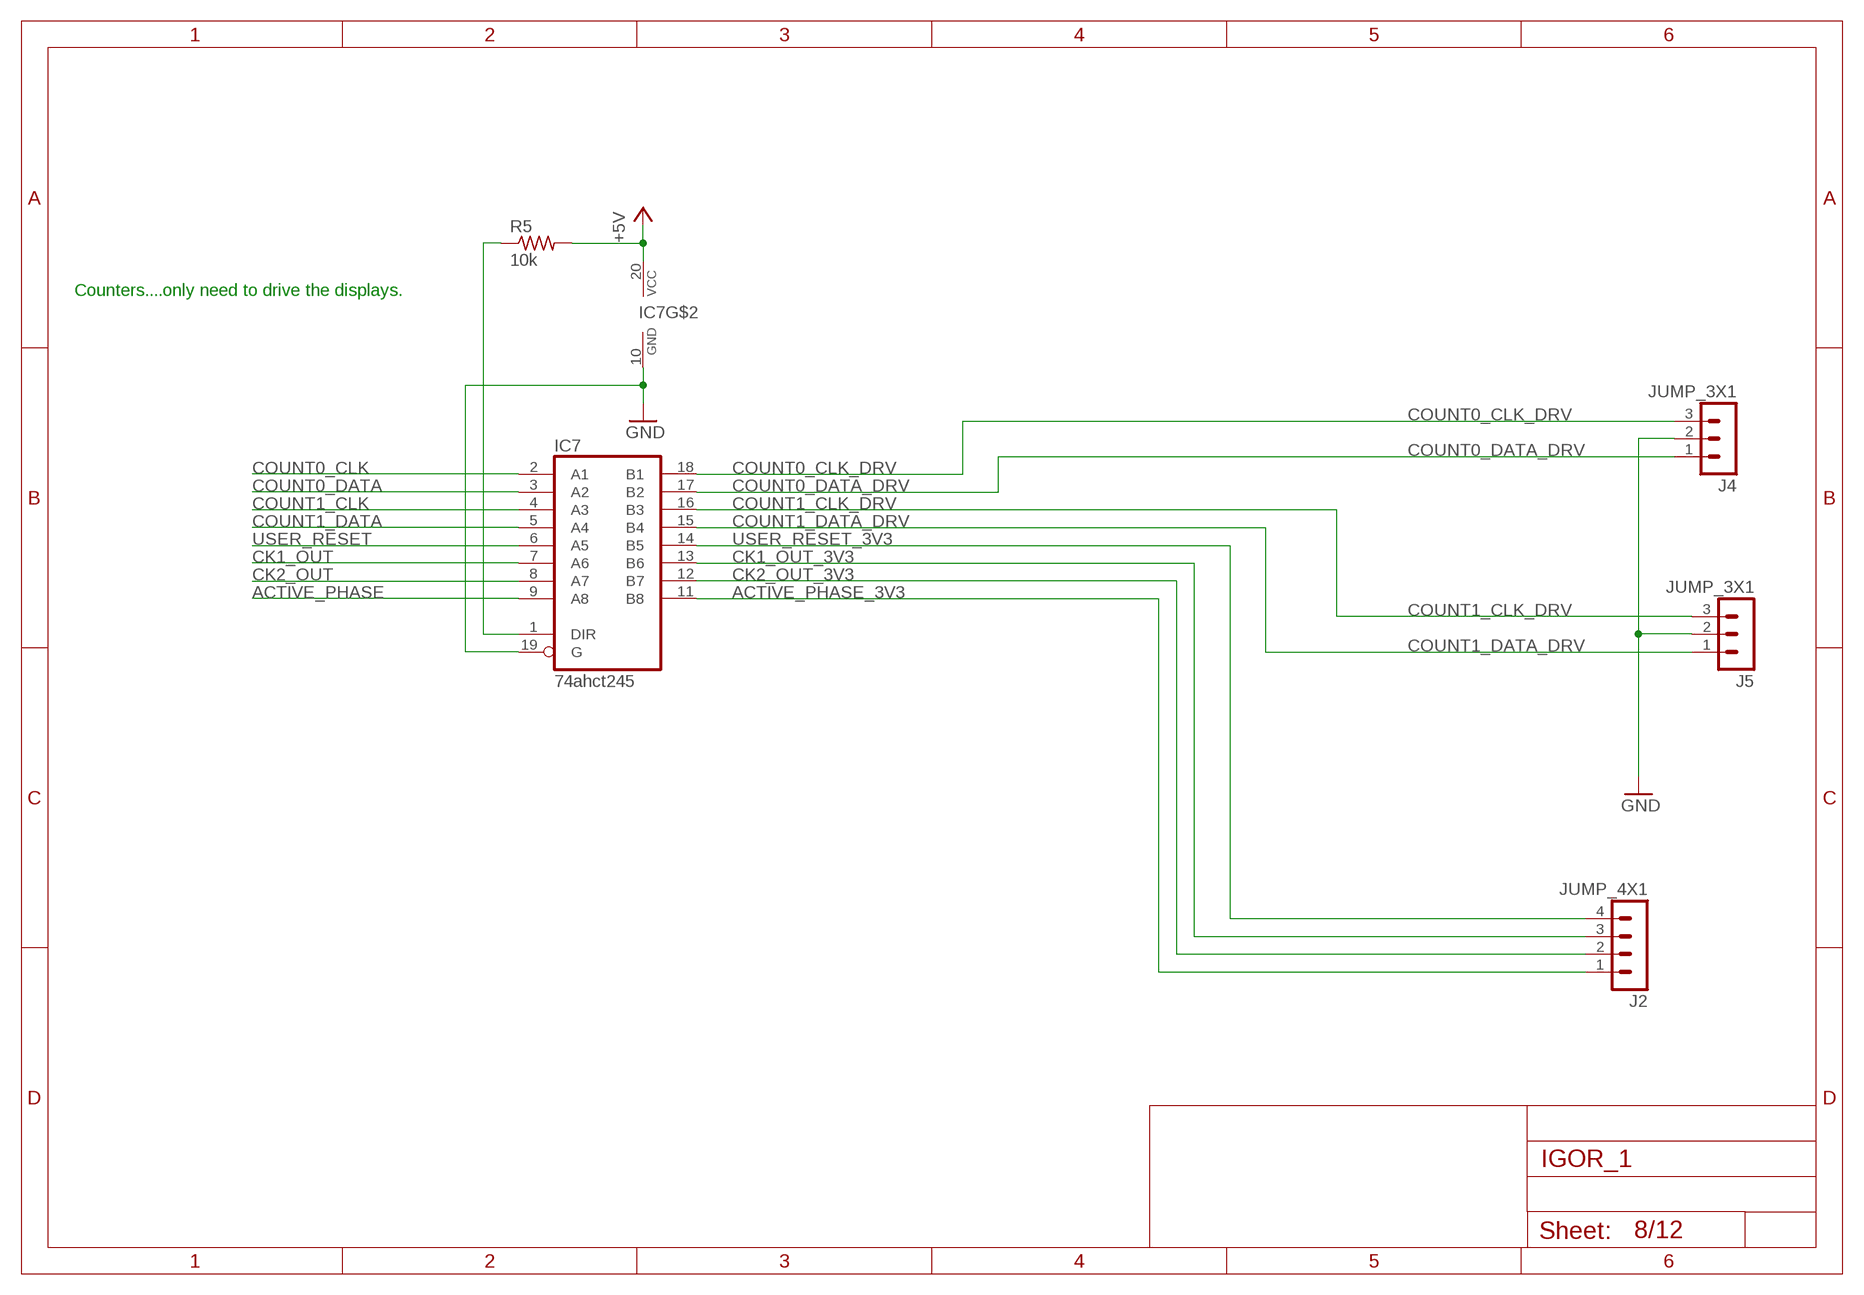
[diagram p7: schematic, sheet 8]

### Parts
IC7  74ahct245  74245  [DIP20]
J2  JUMP_4X1  [JUMP_4X1]
J4  JUMP_3X1  [JUMP_3X1]
J5  JUMP_3X1  [JUMP_3X1]
R5  10k  R_P2INCH  [R_P2INCH]

### Nets
+5V: IC7.20(VCC) R5.2 ; also sheet 1,2,5
ACTIVE_PHASE: IC7.9(A8) ; also sheet 3
ACTIVE_PHASE_3V3: IC7.11(B8) J2.1
CK1_OUT: IC7.7(A6) ; also sheet 3
CK1_OUT_3V3: IC7.13(B6) J2.3
CK2_OUT: IC7.8(A7) ; also sheet 3
CK2_OUT_3V3: IC7.12(B7) J2.2
COUNT0_CLK: IC7.2(A1) ; also sheet 3
COUNT0_CLK_DRV: IC7.18(B1) J4.3
COUNT0_DATA: IC7.3(A2) ; also sheet 3
COUNT0_DATA_DRV: IC7.17(B2) J4.1
COUNT1_CLK: IC7.4(A3) ; also sheet 3
COUNT1_CLK_DRV: IC7.16(B3) J5.3
COUNT1_DATA: IC7.5(A4) ; also sheet 3
COUNT1_DATA_DRV: IC7.15(B4) J5.1
GND: IC7.10(GND) IC7.19(G) J4.2 J5.2 ; also sheet 1,2,3,4,5,6,7,9,10,11,12
N$1: IC7.1(DIR) R5.1
USER_RESET: IC7.6(A5) ; also sheet 3
USER_RESET_3V3: IC7.14(B5) J2.4

### Notes on the sheet
- Counters....only need to drive the displays.

## Sheet 9 of 12
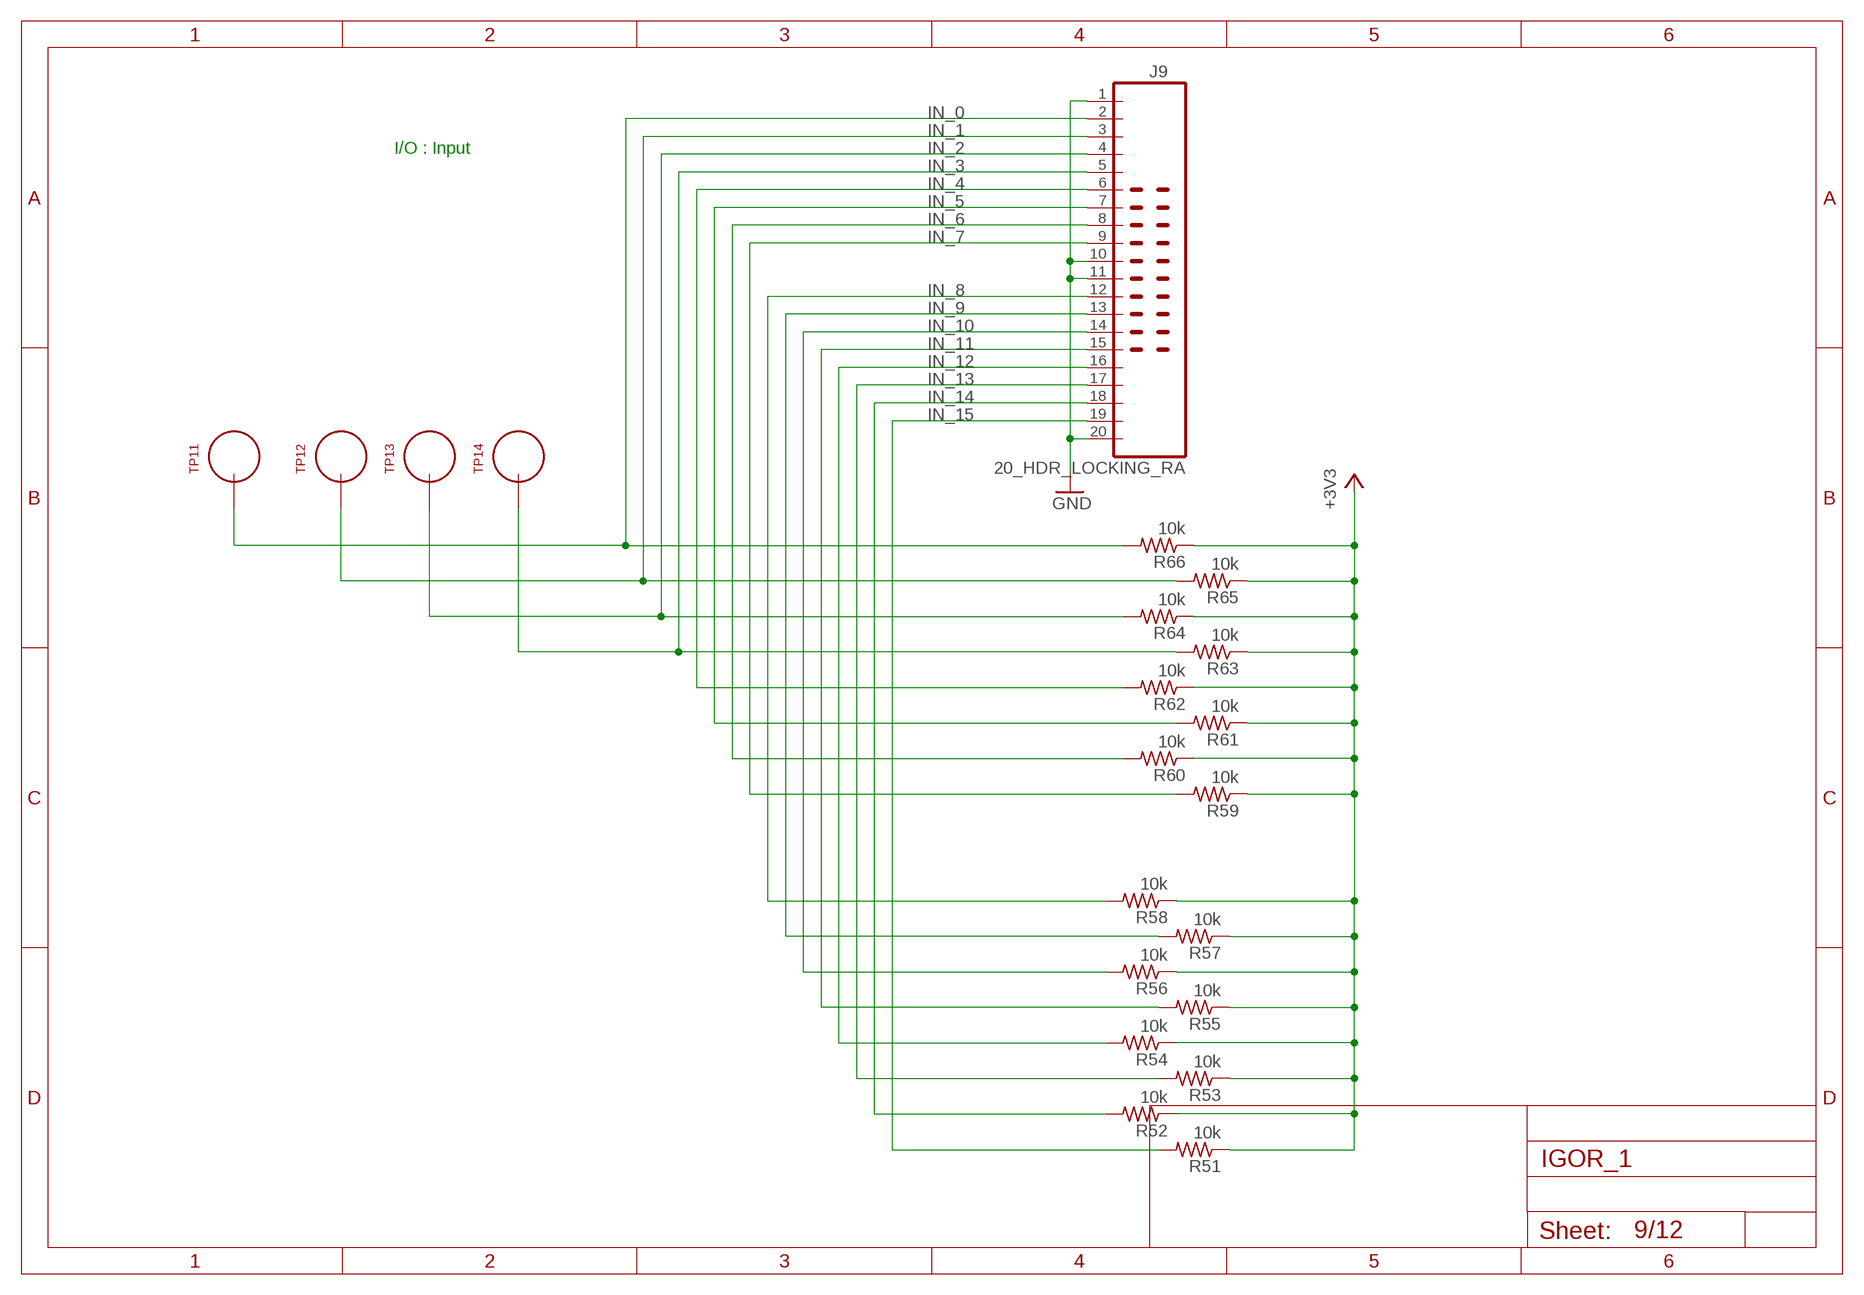
[diagram p8: schematic, sheet 9]

### Parts
J9  20_HDR_LOCKING_RA  [20_HDR_LOCKING_RA]
R51  10k  R_P2INCH  [R_P2INCH]
R52  10k  R_P2INCH  [R_P2INCH]
R53  10k  R_P2INCH  [R_P2INCH]
R54  10k  R_P2INCH  [R_P2INCH]
R55  10k  R_P2INCH  [R_P2INCH]
R56  10k  R_P2INCH  [R_P2INCH]
R57  10k  R_P2INCH  [R_P2INCH]
R58  10k  R_P2INCH  [R_P2INCH]
R59  10k  R_P2INCH  [R_P2INCH]
R60  10k  R_P2INCH  [R_P2INCH]
R61  10k  R_P2INCH  [R_P2INCH]
R62  10k  R_P2INCH  [R_P2INCH]
R63  10k  R_P2INCH  [R_P2INCH]
R64  10k  R_P2INCH  [R_P2INCH]
R65  10k  R_P2INCH  [R_P2INCH]
R66  10k  R_P2INCH  [R_P2INCH]
TP11  TEST_LOOP  [TEST_LOOP]
TP12  TEST_LOOP  [TEST_LOOP]
TP13  TEST_LOOP  [TEST_LOOP]
TP14  TEST_LOOP  [TEST_LOOP]

### Nets
+3V3: R51.1 R52.1 R53.1 R54.1 R55.1 R56.1 R57.1 R58.1 R59.1 R60.1 R61.1 R62.1 R63.1 R64.1 R65.1 R66.1 ; also sheet 1,5,6,7,11
GND: J9.1 J9.10 J9.11 J9.20 ; also sheet 1,2,3,4,5,6,7,8,10,11,12
IN_0: J9.2 R66.2 TP11.P$1 ; also sheet 3
IN_1: J9.3 R65.2 TP12.P$1 ; also sheet 3
IN_2: J9.4 R64.2 TP13.P$1 ; also sheet 3
IN_3: J9.5 R63.2 TP14.P$1 ; also sheet 3
IN_4: J9.6 R62.2 ; also sheet 3
IN_5: J9.7 R61.2 ; also sheet 3
IN_6: J9.8 R60.2 ; also sheet 3
IN_7: J9.9 R59.2 ; also sheet 3
IN_8: J9.12 R58.2 ; also sheet 3
IN_9: J9.13 R57.2 ; also sheet 3
IN_10: J9.14 R56.2 ; also sheet 3
IN_11: J9.15 R55.2 ; also sheet 3
IN_12: J9.16 R54.2 ; also sheet 3
IN_13: J9.17 R53.2 ; also sheet 3
IN_14: J9.18 R52.2 ; also sheet 3
IN_15: J9.19 R51.2 ; also sheet 3

### Notes on the sheet
- I/O : Input

## Sheet 10 of 12
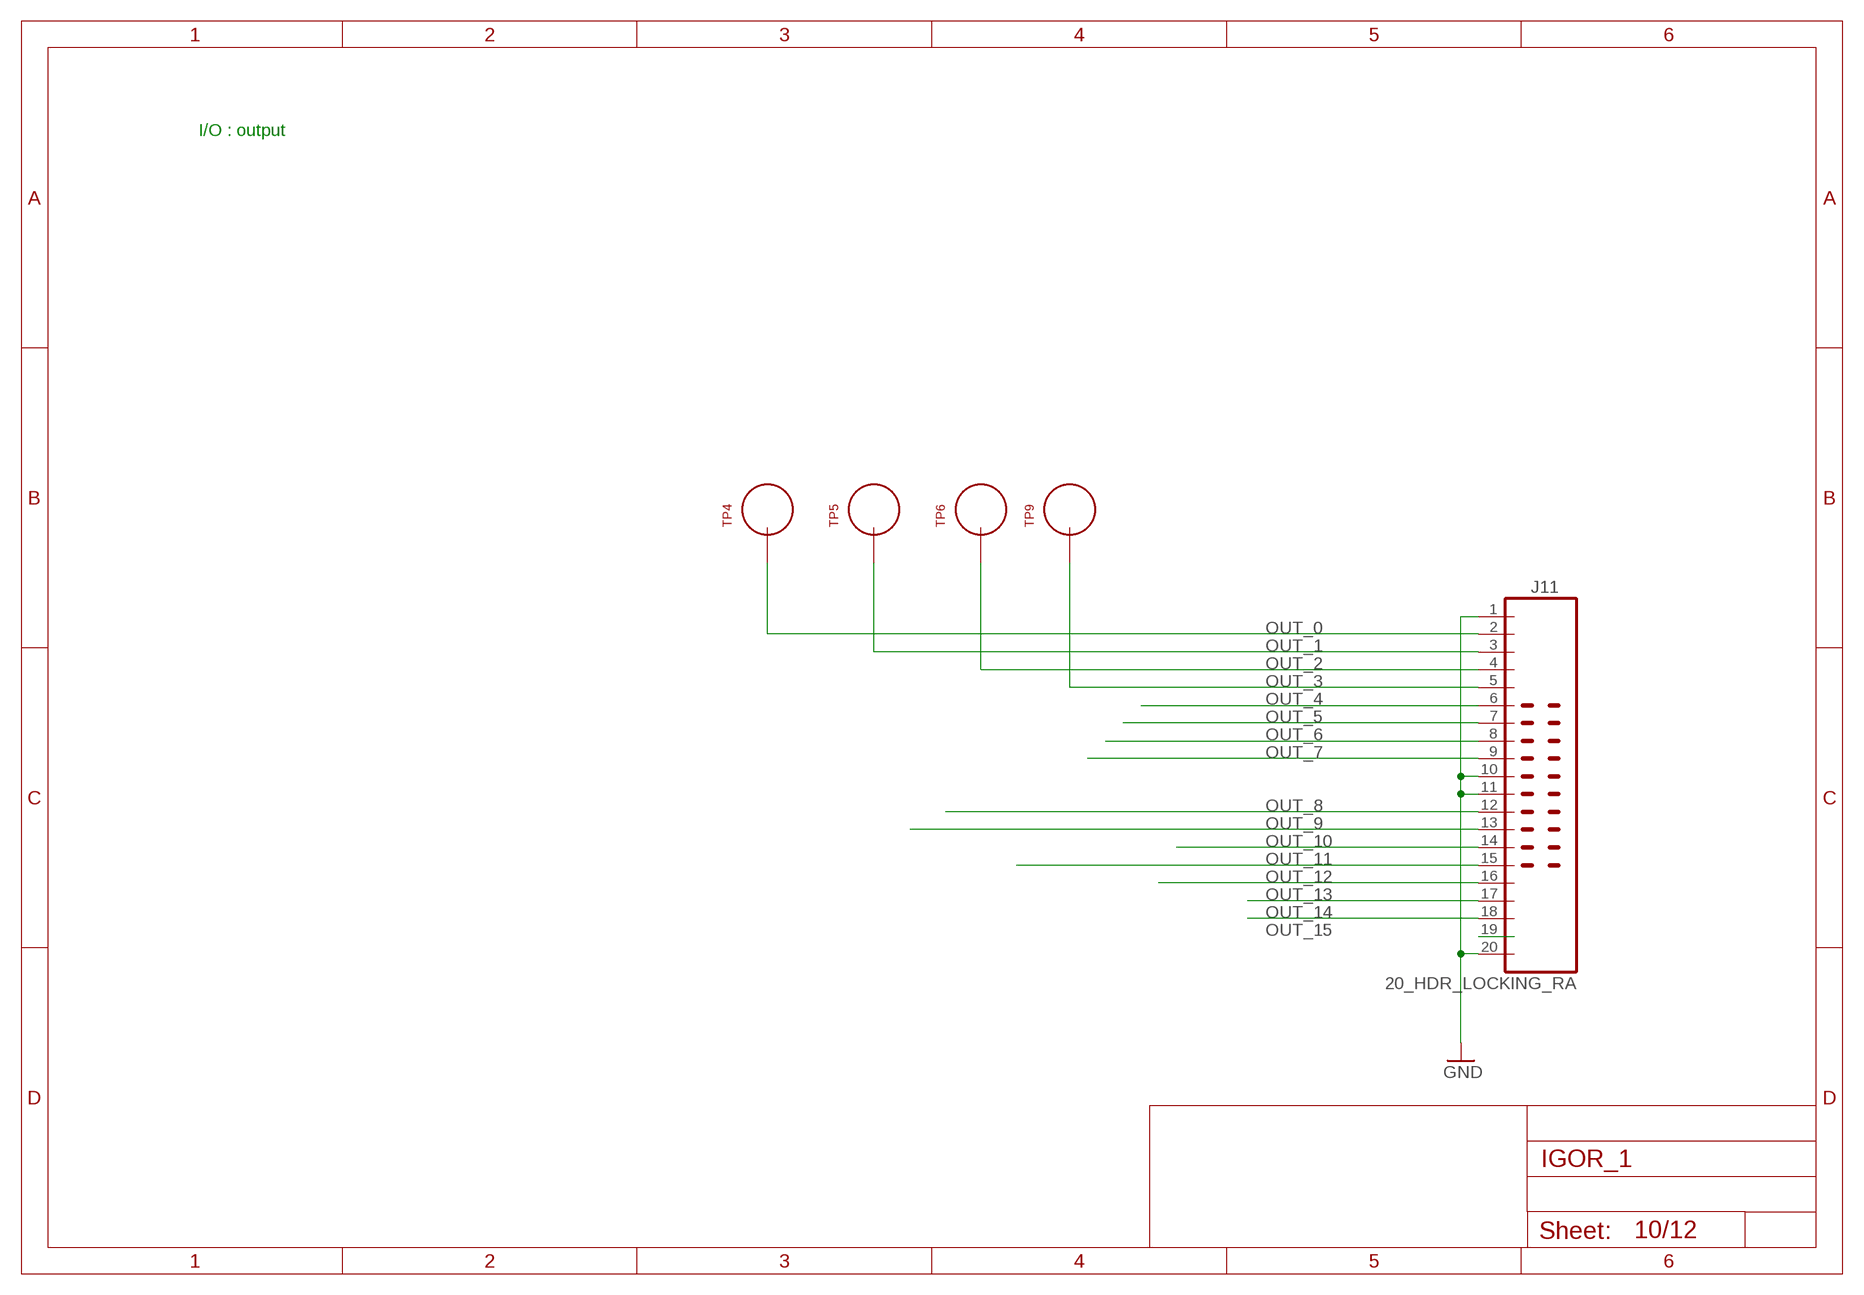
[diagram p9: schematic, sheet 10]

### Parts
J11  20_HDR_LOCKING_RA  [20_HDR_LOCKING_RA]
TP4  TEST_LOOP  [TEST_LOOP]
TP5  TEST_LOOP  [TEST_LOOP]
TP6  TEST_LOOP  [TEST_LOOP]
TP9  TEST_LOOP  [TEST_LOOP]

### Nets
GND: J11.1 J11.10 J11.11 J11.20 ; also sheet 1,2,3,4,5,6,7,8,9,11,12
OUT_0: J11.2 TP4.P$1 ; also sheet 3
OUT_1: J11.3 TP5.P$1 ; also sheet 3
OUT_2: J11.4 TP6.P$1 ; also sheet 3
OUT_3: J11.5 TP9.P$1 ; also sheet 3
OUT_4: J11.6 ; also sheet 3
OUT_5: J11.7 ; also sheet 3
OUT_6: J11.8 ; also sheet 3
OUT_7: J11.9 ; also sheet 3
OUT_8: J11.12 ; also sheet 3
OUT_9: J11.13 ; also sheet 3
OUT_10: J11.14 ; also sheet 3
OUT_11: J11.15 ; also sheet 3
OUT_12: J11.16 ; also sheet 3
OUT_13: J11.17 ; also sheet 3
OUT_14: J11.18 ; also sheet 3
OUT_15: J11.19 ; also sheet 3

### Notes on the sheet
- I/O : output

## Sheet 11 of 12
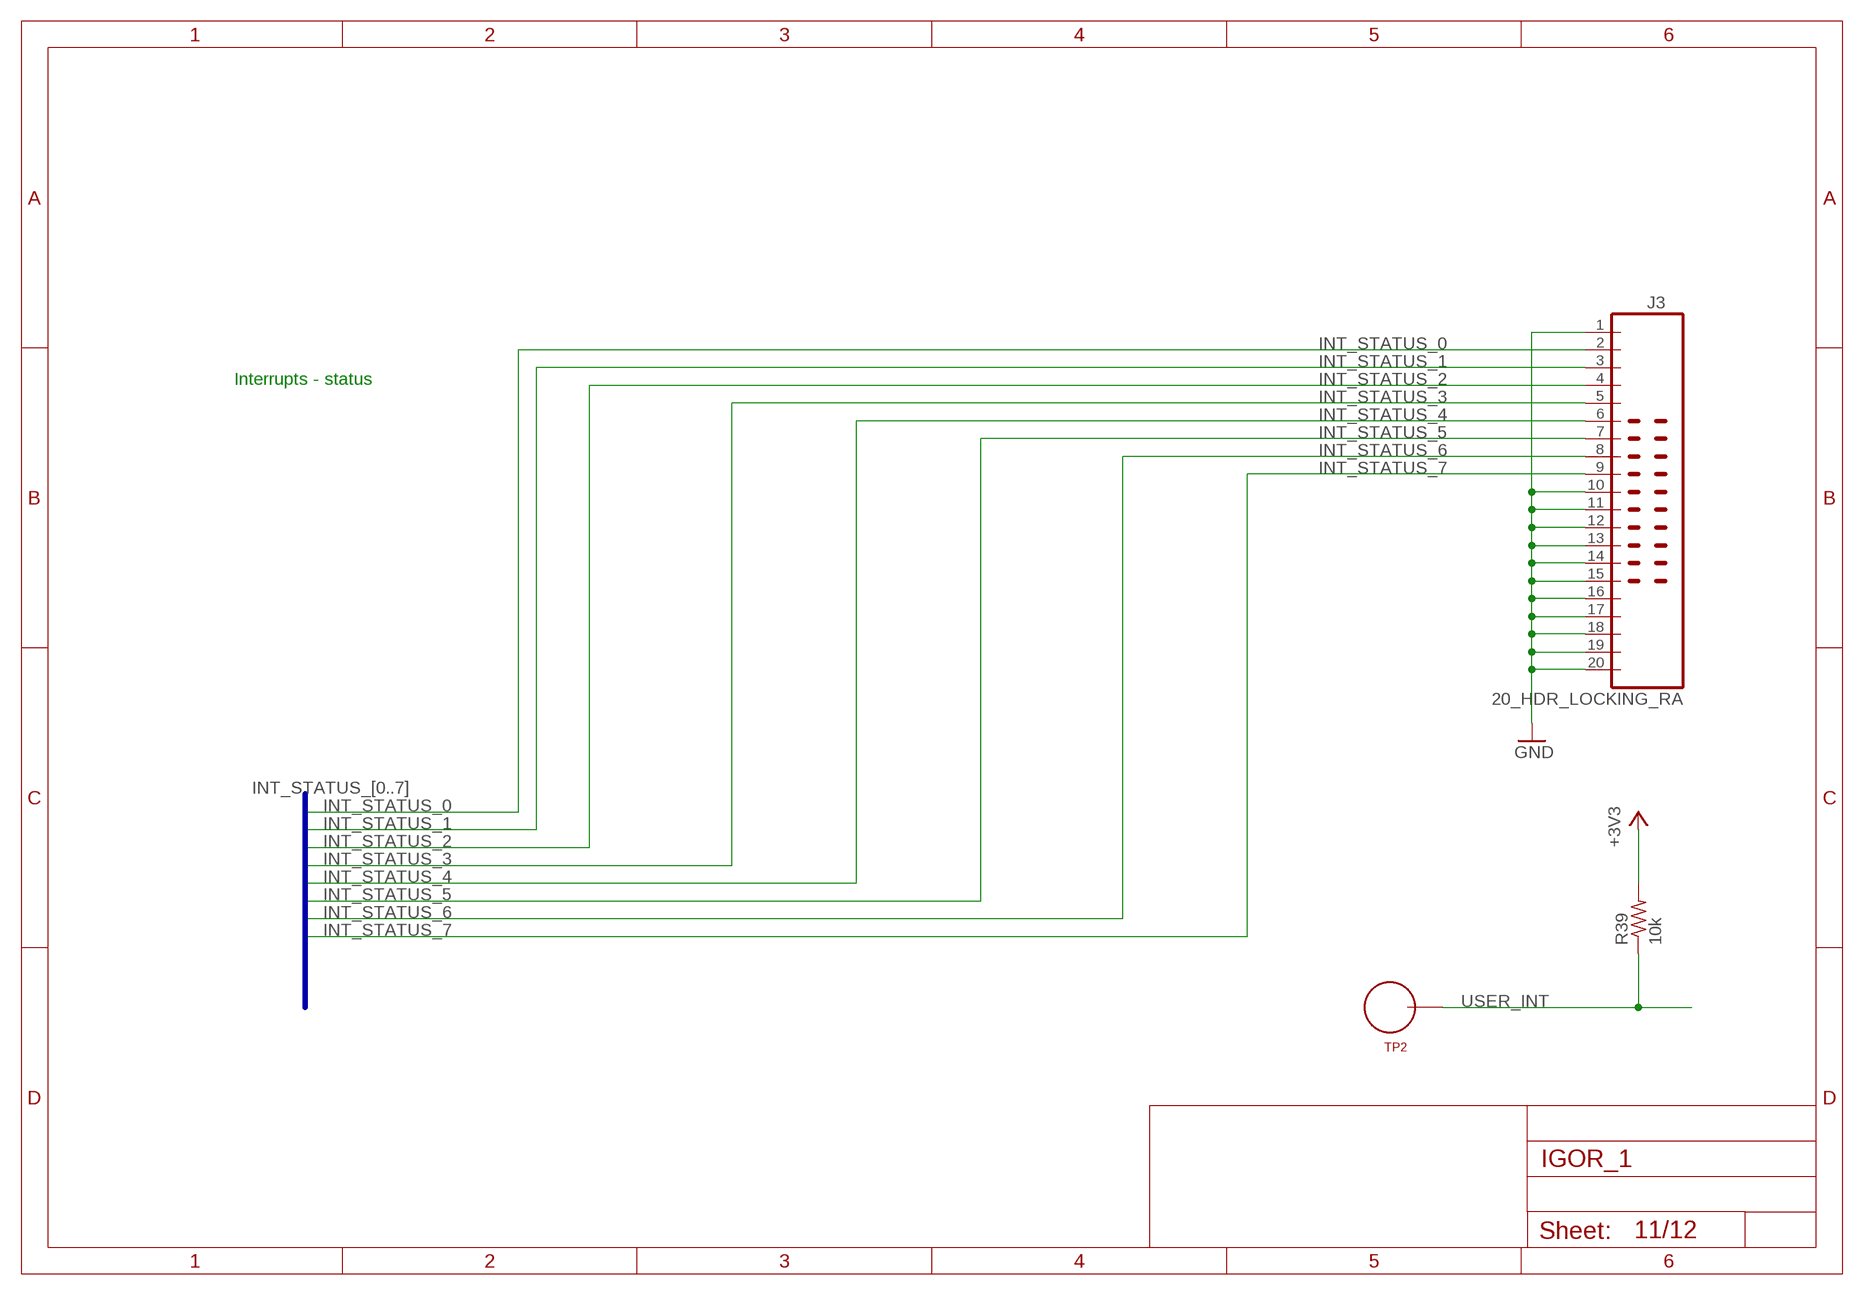
[diagram p10: schematic, sheet 11]

### Parts
J3  20_HDR_LOCKING_RA  [20_HDR_LOCKING_RA]
R39  10k  R_P2INCH  [R_P2INCH]
TP2  TEST_LOOP  [TEST_LOOP]

### Nets
+3V3: R39.2 ; also sheet 1,5,6,7,9
GND: J3.1 J3.10 J3.11 J3.12 J3.13 J3.14 J3.15 J3.16 J3.17 J3.18 J3.19 J3.20 ; also sheet 1,2,3,4,5,6,7,8,9,10,12
INT_STATUS_0: J3.2 ; also sheet 2
INT_STATUS_1: J3.3 ; also sheet 2
INT_STATUS_2: J3.4 ; also sheet 2
INT_STATUS_3: J3.5 ; also sheet 2
INT_STATUS_4: J3.6 ; also sheet 2
INT_STATUS_5: J3.7 ; also sheet 2
INT_STATUS_6: J3.8 ; also sheet 2
INT_STATUS_7: J3.9 ; also sheet 2
USER_INT: R39.1 TP2.P$1 ; also sheet 2

### Buses
INT_STATUS_[0..7]

### Notes on the sheet
- Interrupts - status

## Sheet 12 of 12
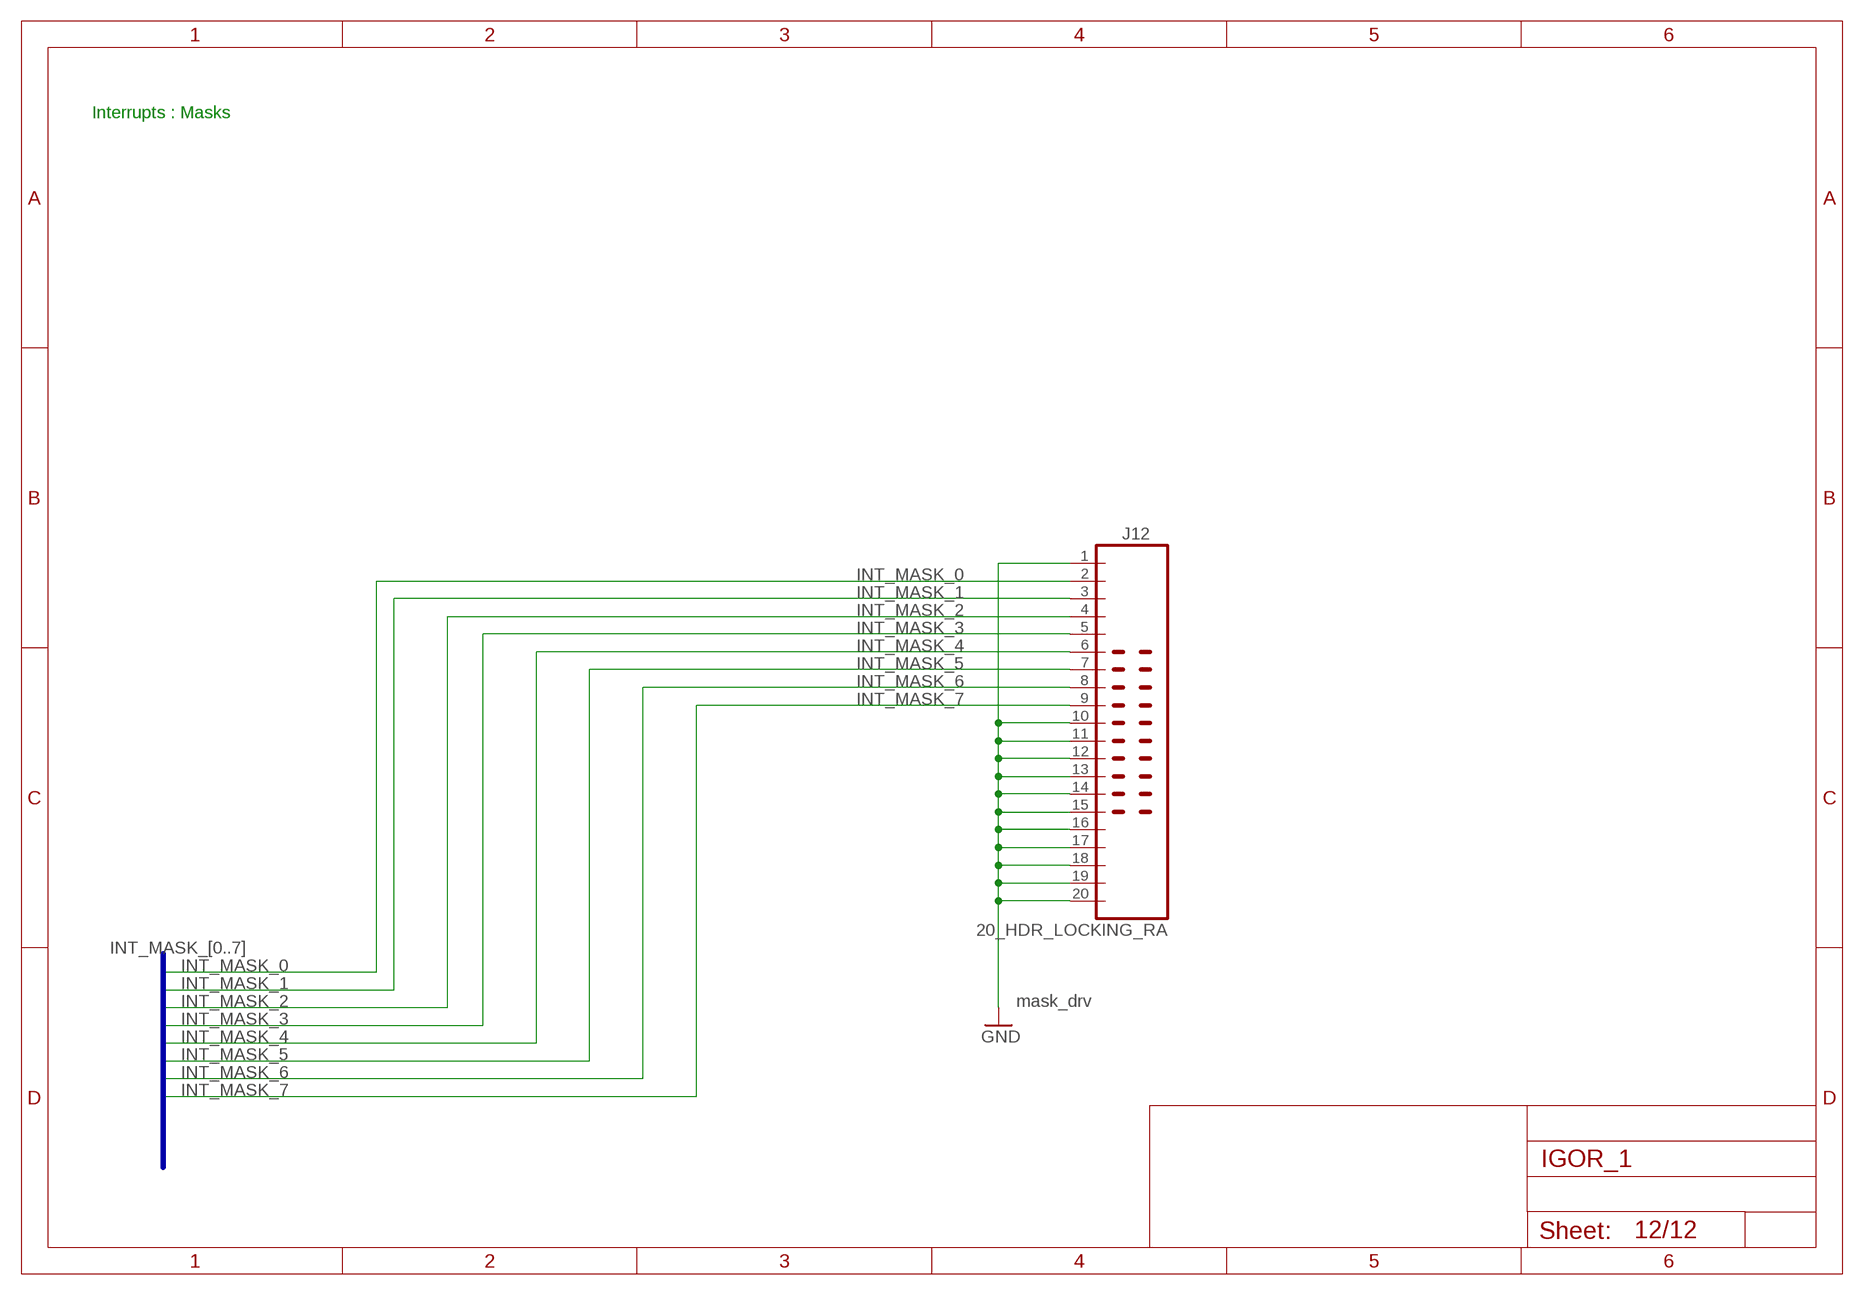
[diagram p11: schematic, sheet 12]

### Parts
J12  20_HDR_LOCKING_RA  [20_HDR_LOCKING_RA]

### Nets
GND: J12.1 J12.10 J12.11 J12.12 J12.13 J12.14 J12.15 J12.16 J12.17 J12.18 J12.19 J12.20 ; also sheet 1,2,3,4,5,6,7,8,9,10,11
INT_MASK_0: J12.2 ; also sheet 2
INT_MASK_1: J12.3 ; also sheet 2
INT_MASK_2: J12.4 ; also sheet 2
INT_MASK_3: J12.5 ; also sheet 2
INT_MASK_4: J12.6 ; also sheet 2
INT_MASK_5: J12.7 ; also sheet 2
INT_MASK_6: J12.8 ; also sheet 2
INT_MASK_7: J12.9 ; also sheet 2

### Buses
INT_MASK_[0..7]

### Notes on the sheet
- Interrupts : Masks
- mask_drv

## Library data of the parts
C1 C4 C5 C7-C12 C15 = MyLib:C_P2INCH
C13 C14 = MyLib:POLARISED_CAP_2P5_6P3MM
HOLE1-HOLE8 = MyLib:3M5_MOUNT_HOLE
IC1-IC5 IC7 = MyLib:74245
IC6 = MyLib:62256: 32kxb RAM
IC8 = MyLib:PIC16F1509-E/P: 20-Pin Flash, 8-Bit Microcontrollers,DIP-20
J1 J3 J7 J9 J11 J12 = MyLib:20_HDR_LOCKING_RA
J2 = MyLib:JUMP_4X1
J4-J6 = MyLib:JUMP_3X1
J14 = MyLib:USB_TYPE_A
J22 = MyLib:JUMP_6X1
L_J3-L_J10 = MyLib:JUMP_20X2
OSC1 = MyLib:OSC_12P9_MM
Q1 = MyLib:2N7000
R1-R3 R5 R39-R41 R51-R66 = MyLib:R_P2INCH
TP1-TP15 = MyLib:TEST_LOOP